# EAGLE design PT_2018_PB_4lyr_Rev1 (EAGLE 8.4.1)
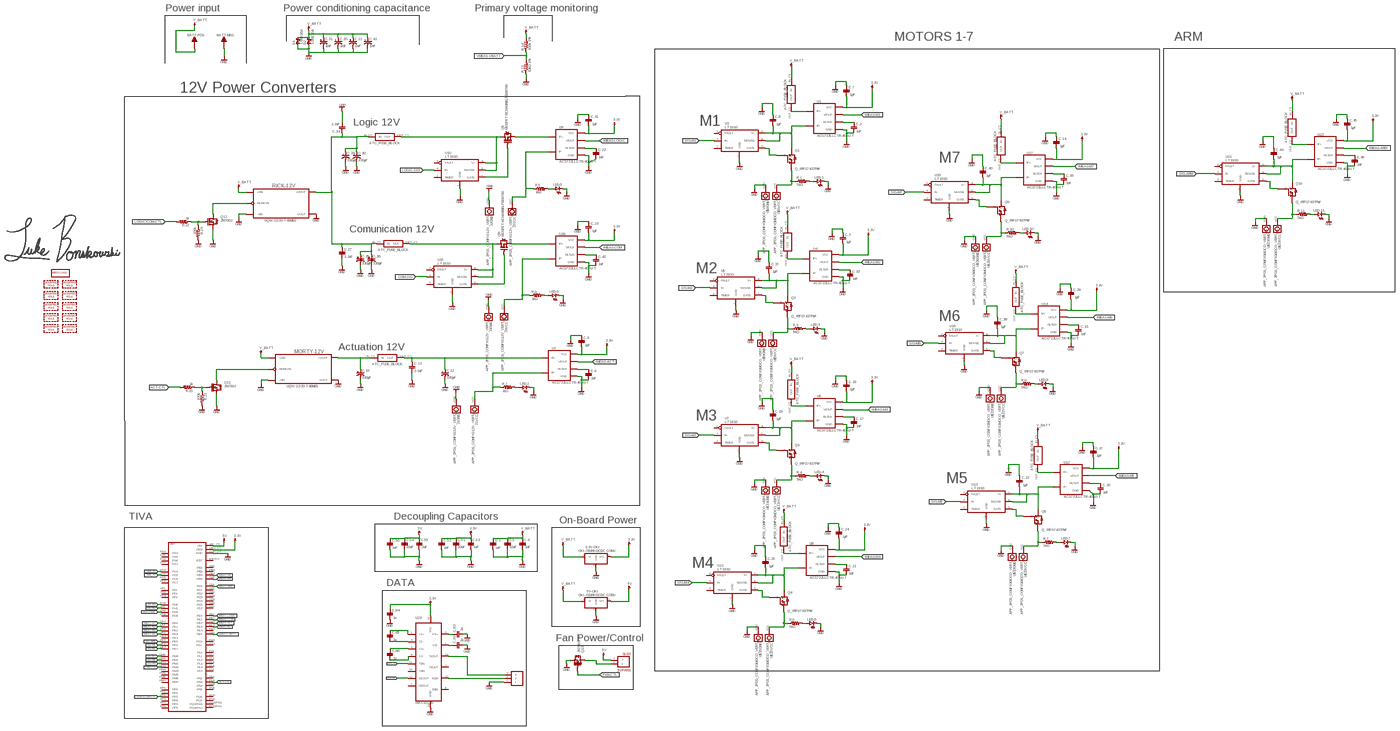
[diagram p0: schematic, sheet 1, overview]
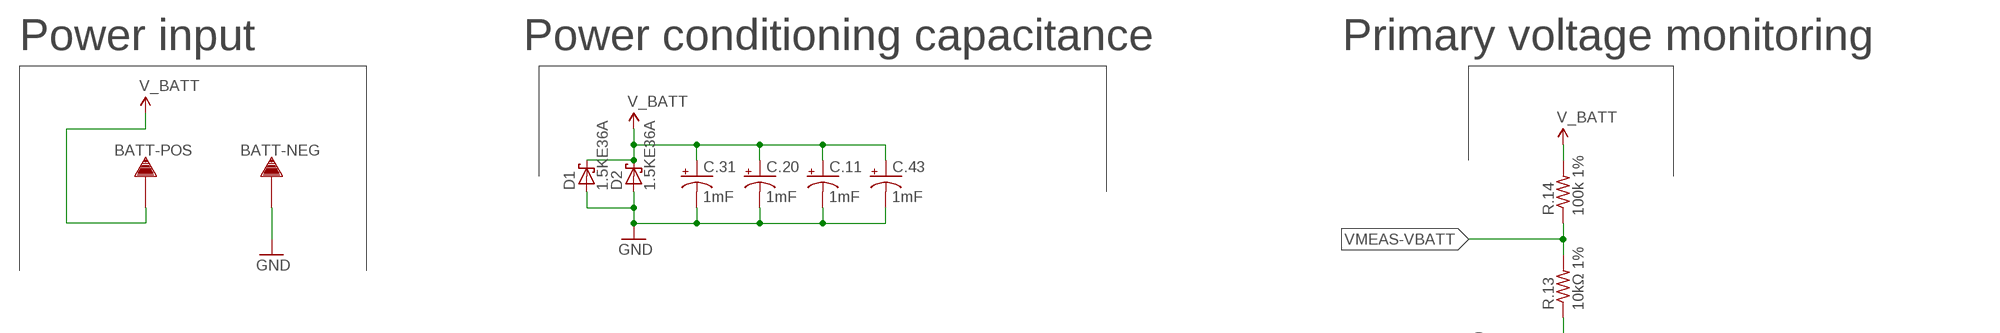
[diagram p1: schematic, sheet 1, part 1 of 4]
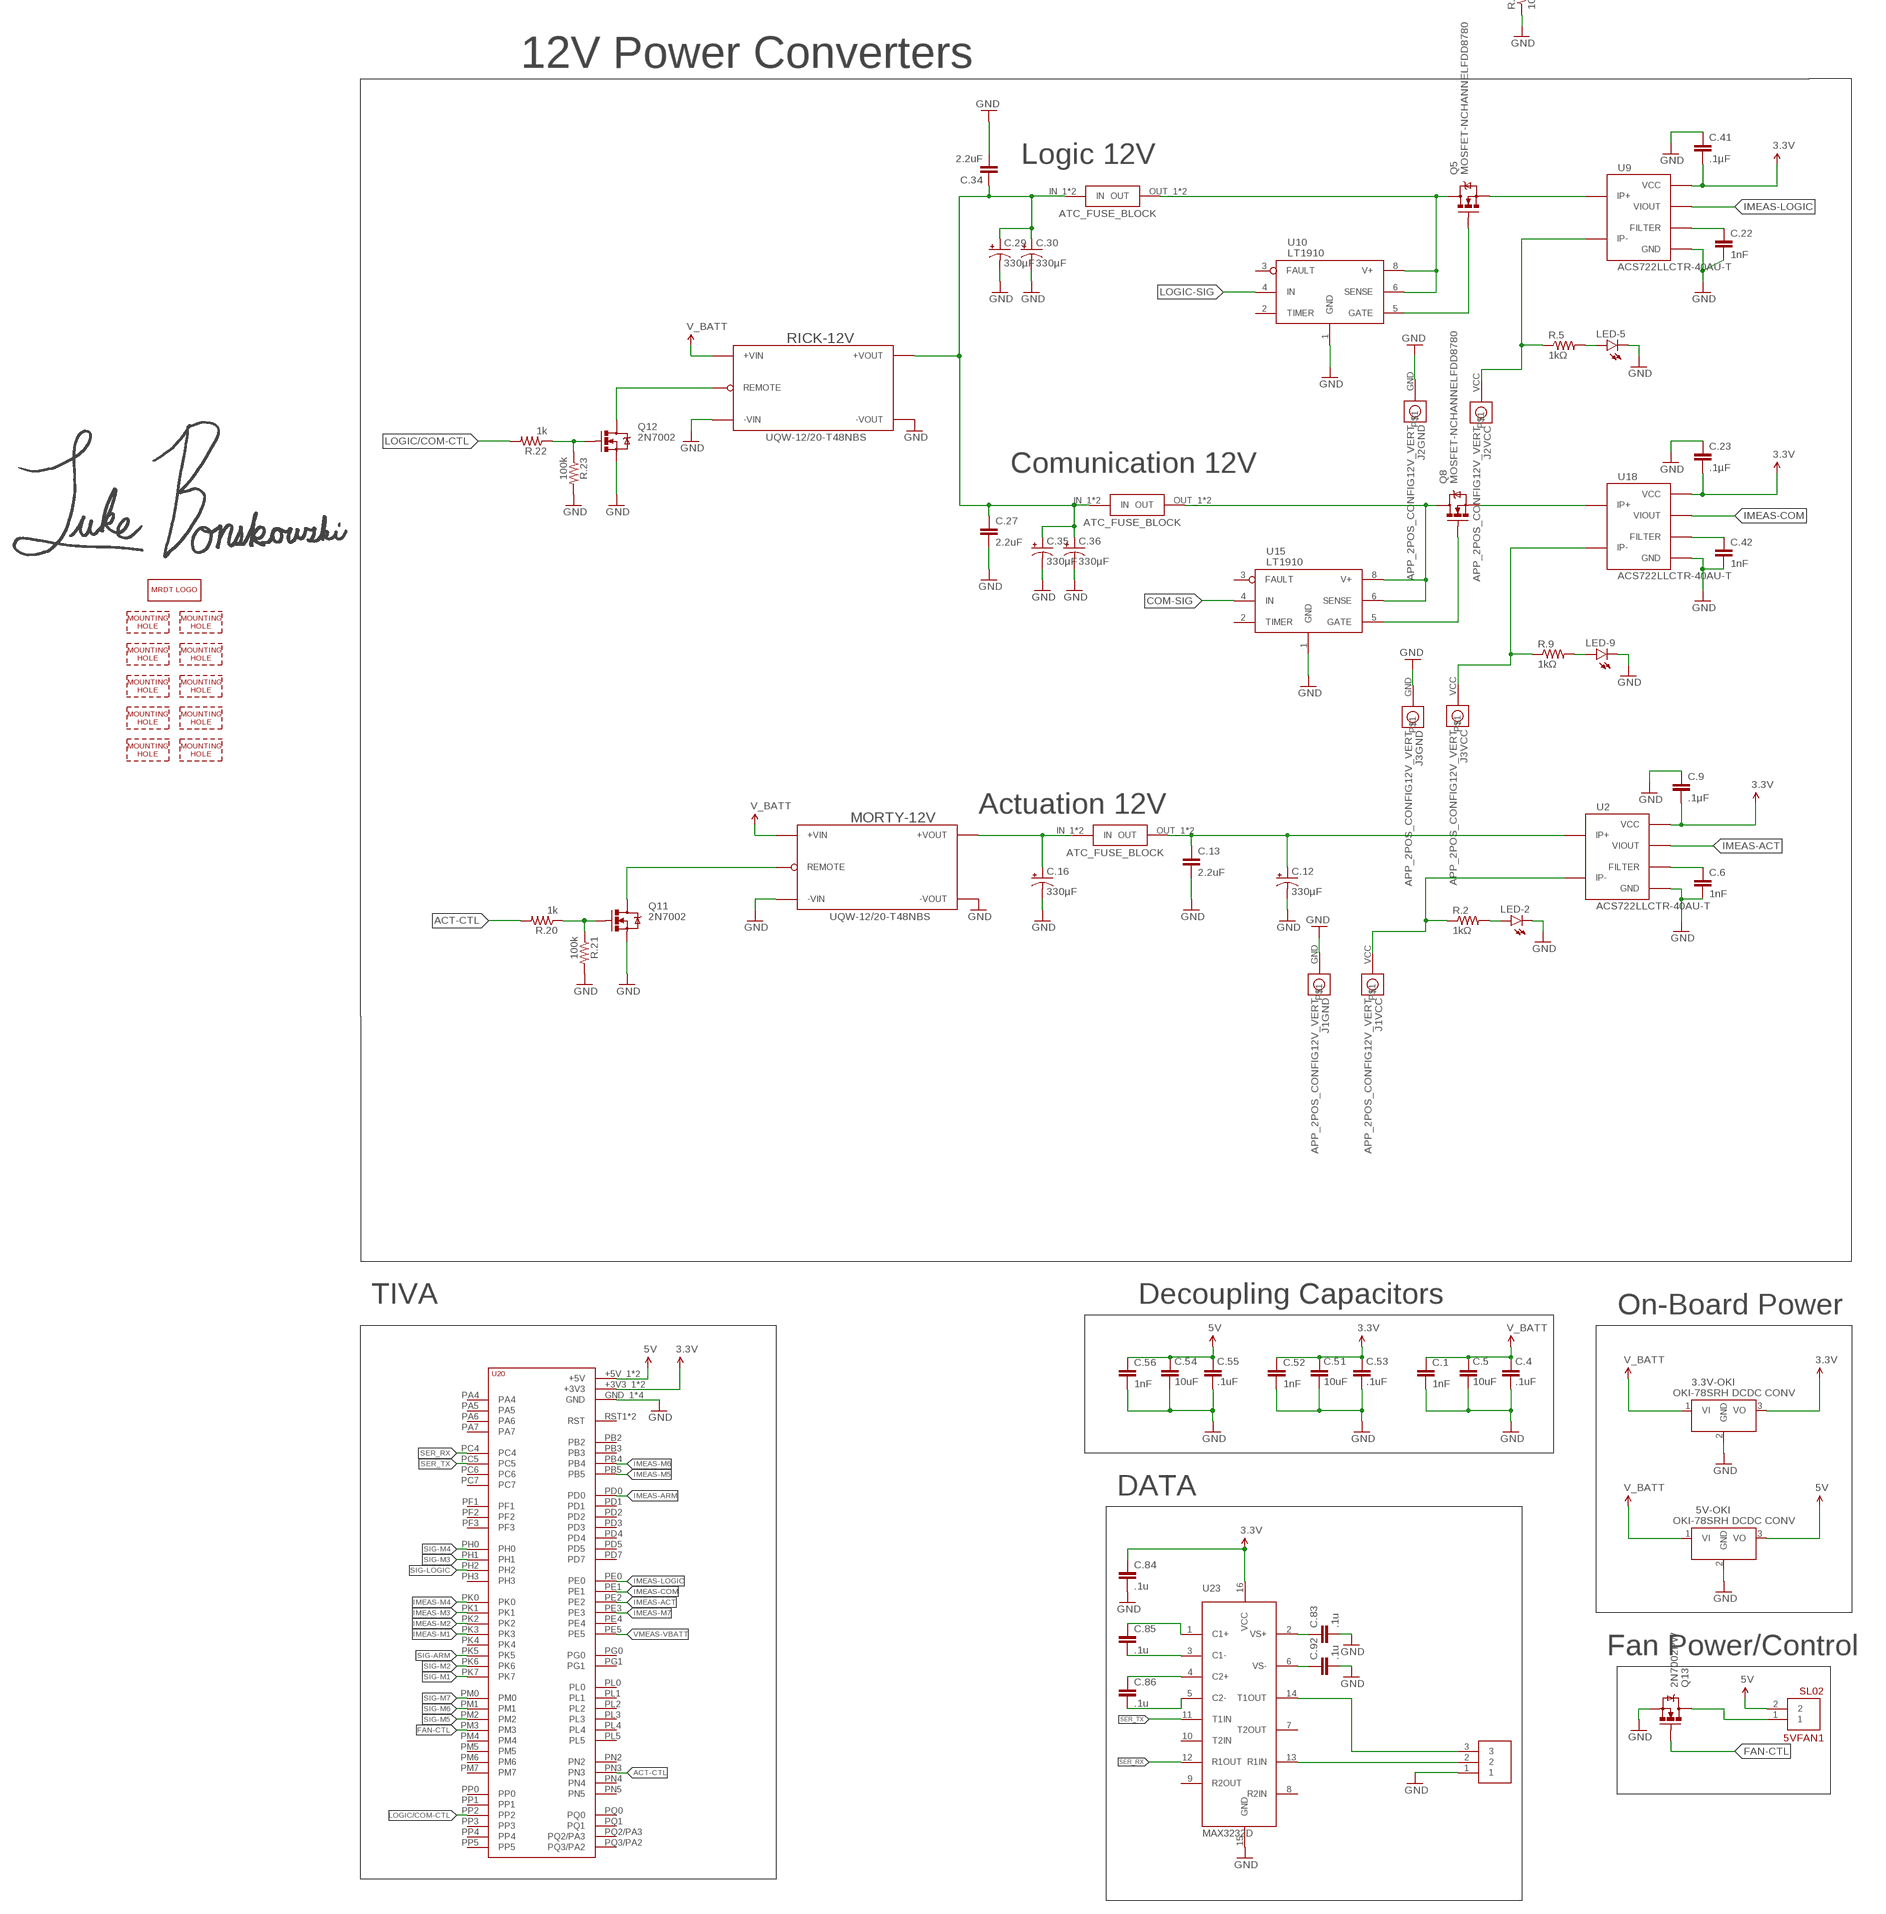
[diagram p2: schematic, sheet 1, part 2 of 4]
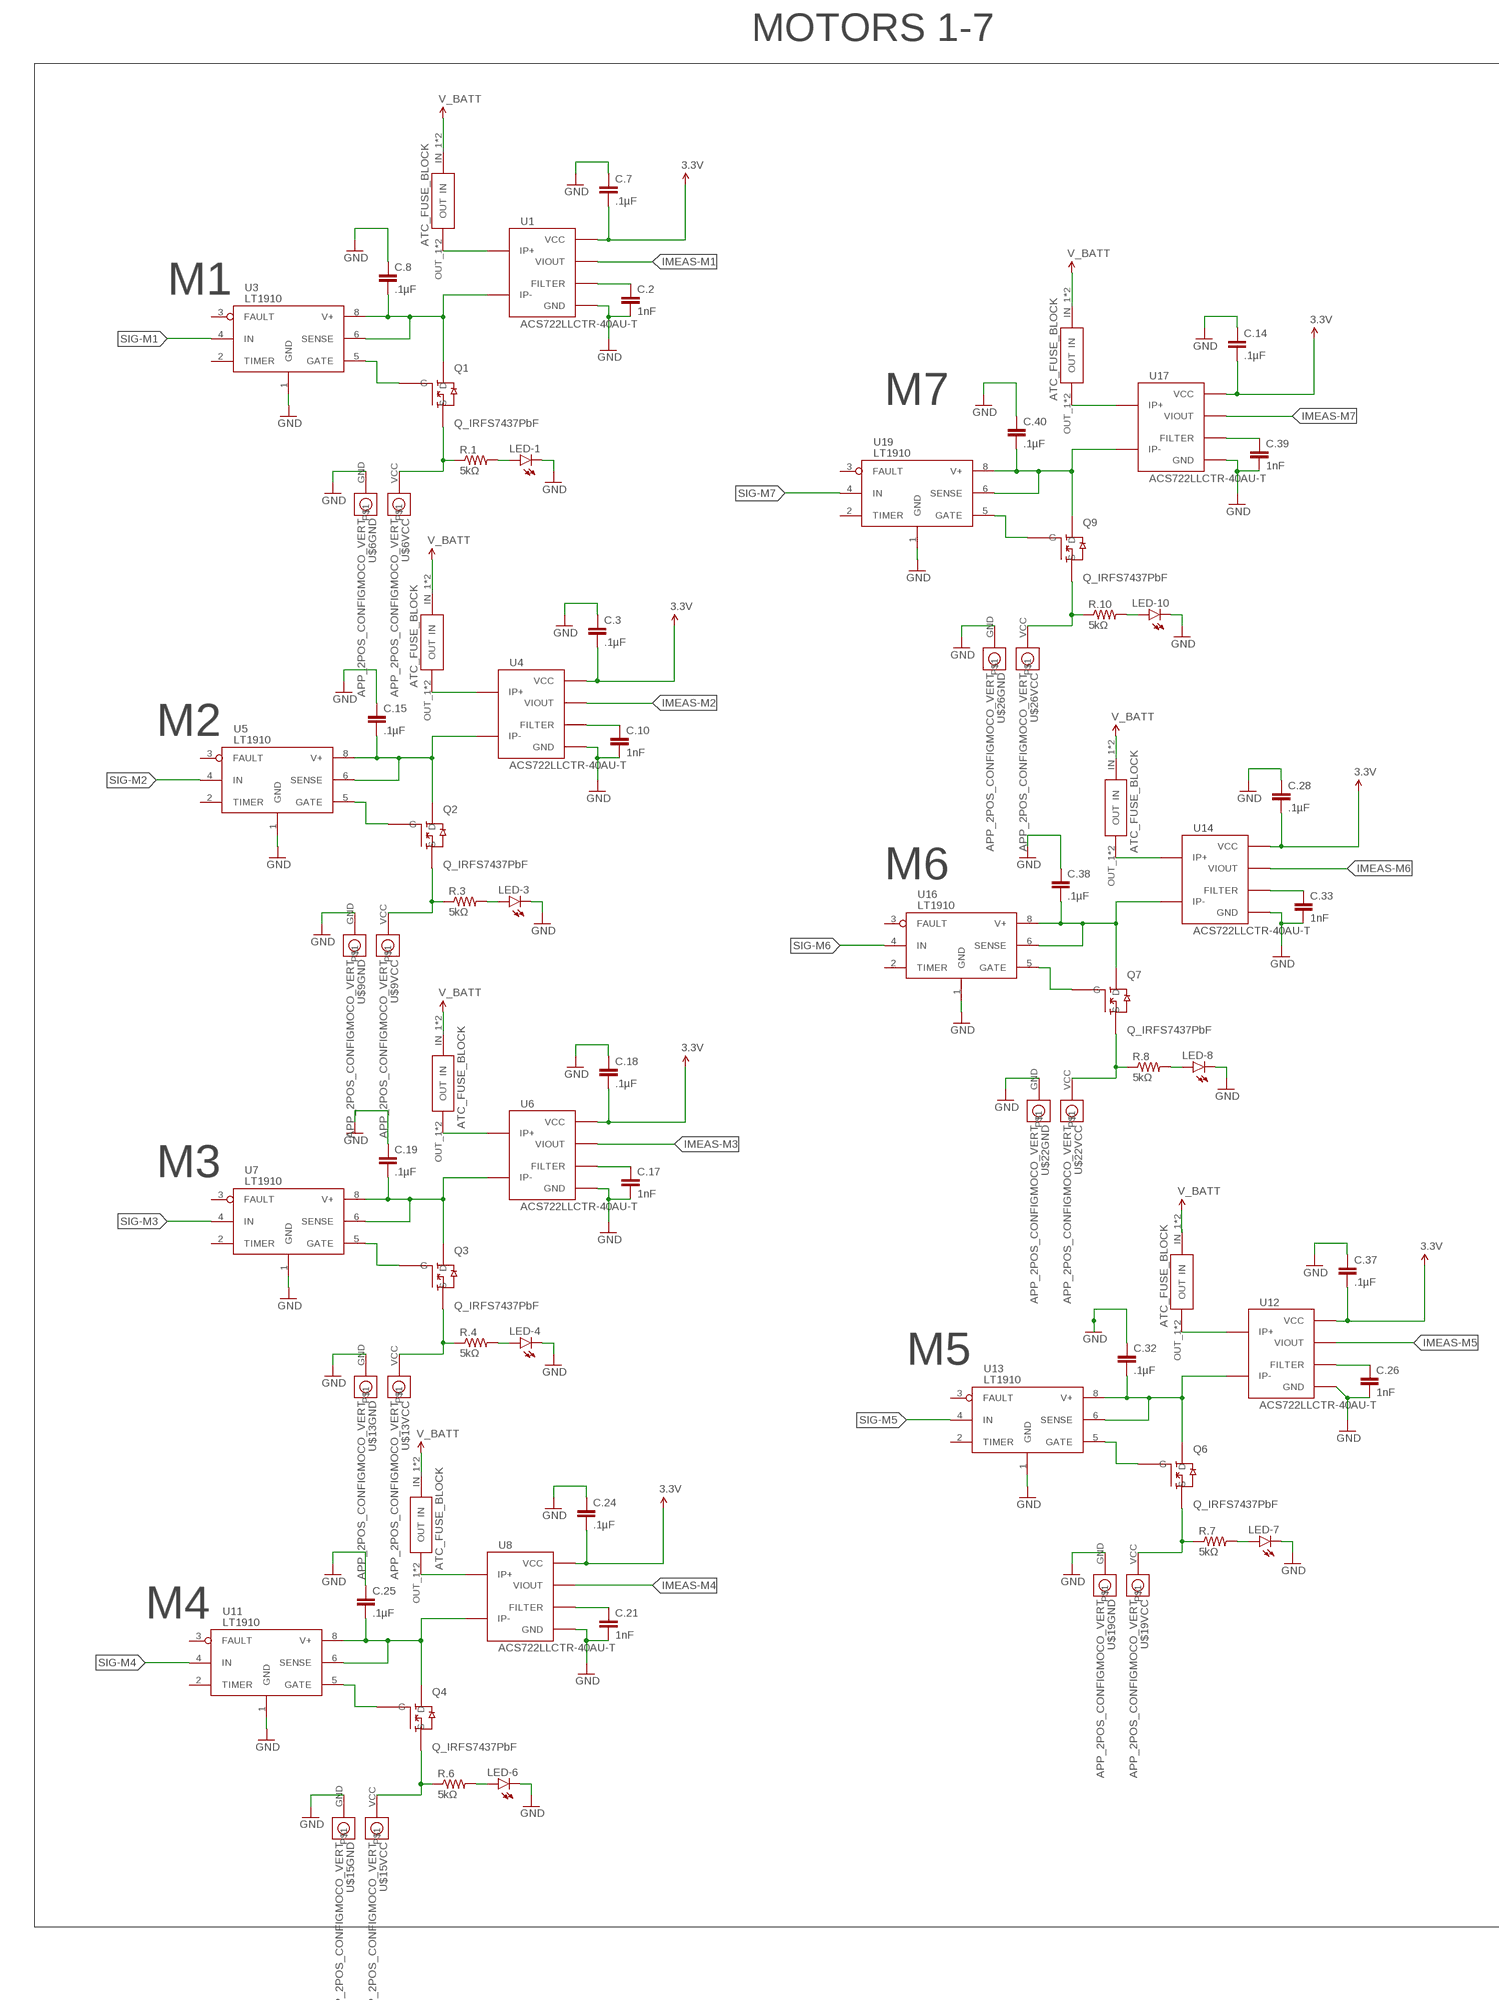
[diagram p3: schematic, sheet 1, part 3 of 4]
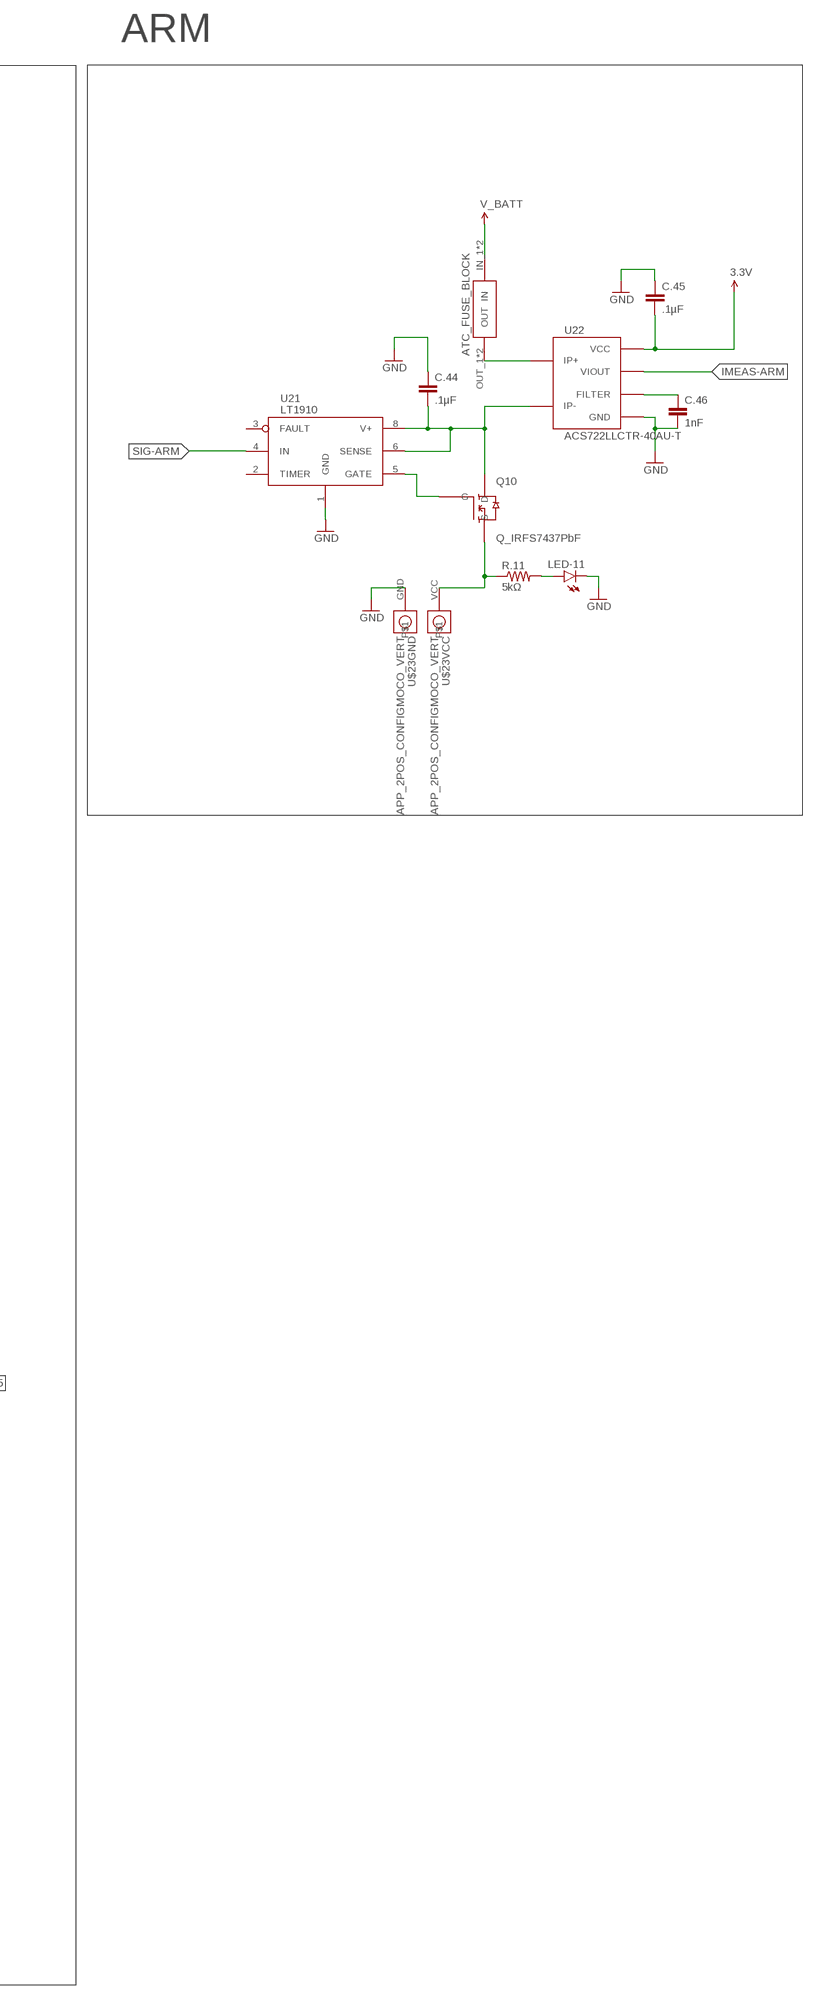
[diagram p4: schematic, sheet 1, part 4 of 4]

## Parts
3.3V-OKI  Q_OKI-78SR  [OKI-78SR_HORIZ]
5V-OKI  Q_OKI-78SR  [OKI-78SR_HORIZ]
5VFAN1  SL02  [MOLEX-70543-0001]
BATT-NEG  TERMINAL_HOLE  [LARGE_TERMINAL_HOLE]
BATT-POS  TERMINAL_HOLE  [LARGE_TERMINAL_HOLE]
BMS_SERIAL  SL03  [MOLEX-70543-0002]
C.1  1nF  CAP0805  [0805]
C.2  1nF  CAP0805  [0805]
C.3  .1µF  CAP0805  [0805]
C.4  .1uF  CAP0805  [0805]
C.5  10uF  CAP1206  [1206]
C.6  1nF  CAP0805  [0805]
C.7  .1µF  CAP0805  [0805]
C.8  .1µF  CAP0805  [0805]
C.9  .1µF  CAP0805  [0805]
C.10  1nF  CAP0805  [0805]
C.11  1mF  C_POL12.5MM_NORMAL  [C_12.5MM]
C.12  330µF  CPOL-USE5-8.5  [E5-8,5]
C.13  2.2uF  CAP1206  [1206]
C.14  .1µF  CAP0805  [0805]
C.15  .1µF  CAP0805  [0805]
C.16  330µF  CPOL-USE5-8.5  [E5-8,5]
C.17  1nF  CAP0805  [0805]
C.18  .1µF  CAP0805  [0805]
C.19  .1µF  CAP0805  [0805]
C.20  1mF  C_POL12.5MM_NORMAL  [C_12.5MM]
C.21  1nF  CAP0805  [0805]
C.22  1nF  CAP0805  [0805]
C.23  .1µF  CAP0805  [0805]
C.24  .1µF  CAP0805  [0805]
C.25  .1µF  CAP0805  [0805]
C.26  1nF  CAP0805  [0805]
C.27  2.2uF  CAP1206  [1206]
C.28  .1µF  CAP0805  [0805]
C.29  330µF  CPOL-USE5-8.5  [E5-8,5]
C.30  330µF  CPOL-USE5-8.5  [E5-8,5]
C.31  1mF  C_POL12.5MM_NORMAL  [C_12.5MM]
C.32  .1µF  CAP0805  [0805]
C.33  1nF  CAP0805  [0805]
C.34  2.2uF  CAP1206  [1206]
C.35  330µF  CPOL-USE5-8.5  [E5-8,5]
C.36  330µF  CPOL-USE5-8.5  [E5-8,5]
C.37  .1µF  CAP0805  [0805]
C.38  .1µF  CAP0805  [0805]
C.39  1nF  CAP0805  [0805]
C.40  .1µF  CAP0805  [0805]
C.41  .1µF  CAP0805  [0805]
C.42  1nF  CAP0805  [0805]
C.43  1mF  C_POL12.5MM_NORMAL  [C_12.5MM]
C.44  .1µF  CAP0805  [0805]
C.45  .1µF  CAP0805  [0805]
C.46  1nF  CAP0805  [0805]
C.51  10uF  CAP1206  [1206]
C.52  1nF  CAP0805  [0805]
C.53  .1uF  CAP0805  [0805]
C.54  10uF  CAP1206  [1206]
C.55  .1uF  CAP0805  [0805]
C.56  1nF  CAP0805  [0805]
C.83  .1u  CAP0805  [0805]
C.84  .1u  CAP0805  [0805]
C.85  .1u  CAP0805  [0805]
C.86  .1u  CAP0805  [0805]
C.92  .1u  CAP0805  [0805]
D1  1.5KE36A  15KEXX  [CB429-17]
D2  1.5KE36A  15KEXX  [CB429-17]
J1  APP_2POS_CONFIG12V_VERT  [APP45_12V_VERT_CONFIG]
J2  APP_2POS_CONFIG12V_VERT  [APP45_12V_VERT_CONFIG]
J3  APP_2POS_CONFIG12V_VERT  [APP45_12V_VERT_CONFIG]
LED-1  LED1206  [LED-1206]
LED-2  LED1206  [LED-1206]
LED-3  LED1206  [LED-1206]
LED-4  LED1206  [LED-1206]
LED-5  LED1206  [LED-1206]
LED-6  LED1206  [LED-1206]
LED-7  LED1206  [LED-1206]
LED-8  LED1206  [LED-1206]
LED-9  LED1206  [LED-1206]
LED-10  LED1206  [LED-1206]
LED-11  LED1206  [LED-1206]
MORTY-12V  UQW-12/20-T48NBS  [U-T48-QB-NO_TRIM]
Q1  Q_IRFS7437PbF  Q_IRF7437SMD  [D2PACK]
Q2  Q_IRFS7437PbF  Q_IRF7437SMD  [D2PACK]
Q3  Q_IRFS7437PbF  Q_IRF7437SMD  [D2PACK]
Q4  Q_IRFS7437PbF  Q_IRF7437SMD  [D2PACK]
Q5  MOSFET-NCHANNELFDD8780  [DPAK]
Q6  Q_IRFS7437PbF  Q_IRF7437SMD  [D2PACK]
Q7  Q_IRFS7437PbF  Q_IRF7437SMD  [D2PACK]
Q8  MOSFET-NCHANNELFDD8780  [DPAK]
Q9  Q_IRFS7437PbF  Q_IRF7437SMD  [D2PACK]
Q10  Q_IRFS7437PbF  Q_IRF7437SMD  [D2PACK]
Q11  2N7002  MOSFET-NCHANNEL2N7002PW  [SOT323]
Q12  2N7002  MOSFET-NCHANNEL2N7002PW  [SOT323]
Q13  2N7002PW  MOSFET-NCHANNEL2N7002PW  [SOT323]
R.1  5kΩ  RESISTOR1206  [1206]
R.2  1kΩ  RESISTOR1206  [1206]
R.3  5kΩ  RESISTOR1206  [1206]
R.4  5kΩ  RESISTOR1206  [1206]
R.5  1kΩ  RESISTOR1206  [1206]
R.6  5kΩ  RESISTOR1206  [1206]
R.7  5kΩ  RESISTOR1206  [1206]
R.8  5kΩ  RESISTOR1206  [1206]
R.9  1kΩ  RESISTOR1206  [1206]
R.10  5kΩ  RESISTOR1206  [1206]
R.11  5kΩ  RESISTOR1206  [1206]
R.13  10kΩ 1%  R-US_R1206  [R1206]
R.14  100k 1%  R-US_R1206  [R1206]
R.20  1k  R-US_R1206  [R1206]
R.21  100k  R-US_R1206  [R1206]
R.22  1k  R-US_R1206  [R1206]
R.23  100k  R-US_R1206  [R1206]
RICK-12V  UQW-12/20-T48NBS  [U-T48-QB-NO_TRIM]
U1  ACS722LLCTR-40AU-T  Q_ACS714  [SOIC8_ACS711]
U2  ACS722LLCTR-40AU-T  Q_ACS714  [SOIC8_ACS711]
U3  LT1910  [SO8]
U4  ACS722LLCTR-40AU-T  Q_ACS714  [SOIC8_ACS711]
U5  LT1910  [SO8]
U6  ACS722LLCTR-40AU-T  Q_ACS714  [SOIC8_ACS711]
U7  LT1910  [SO8]
U8  ACS722LLCTR-40AU-T  Q_ACS714  [SOIC8_ACS711]
U9  ACS722LLCTR-40AU-T  Q_ACS714  [SOIC8_ACS711]
U10  LT1910  [SO8]
U11  LT1910  [SO8]
U12  ACS722LLCTR-40AU-T  Q_ACS714  [SOIC8_ACS711]
U13  LT1910  [SO8]
U14  ACS722LLCTR-40AU-T  Q_ACS714  [SOIC8_ACS711]
U15  LT1910  [SO8]
U16  LT1910  [SO8]
U17  ACS722LLCTR-40AU-T  Q_ACS714  [SOIC8_ACS711]
U18  ACS722LLCTR-40AU-T  Q_ACS714  [SOIC8_ACS711]
U19  LT1910  [SO8]
U20  TIVA-1294  [TIVA-C-CONNECTED]
U21  LT1910  [SO8]
U22  ACS722LLCTR-40AU-T  Q_ACS714  [SOIC8_ACS711]
U23  MAX3232D  [SOIC16]
U$1  MOUNTING_HOLE#6  [#6_SCREW]
U$2  MOUNTING_HOLE#6  [#6_SCREW]
U$3  MOUNTING_HOLE#6  [#6_SCREW]
U$4  MOUNTING_HOLE#6  [#6_SCREW]
U$5  ATC_FUSE_BLOCK  [BLOCK_3557-2]
U$6  APP_2POS_CONFIGMOCO_VERT  [APP45_MOCO_VERT_CONFIG]
U$7  ATC_FUSE_BLOCK  [BLOCK_3557-2]
U$8  MRDT_LOGO  [MRDT_LOGO]
U$9  APP_2POS_CONFIGMOCO_VERT  [APP45_MOCO_VERT_CONFIG]
U$10  ATC_FUSE_BLOCK  [BLOCK_3557-2]
U$11  ATC_FUSE_BLOCK  [BLOCK_3557-2]
U$12  MOUNTING_HOLE#6  [#6_SCREW]
U$13  APP_2POS_CONFIGMOCO_VERT  [APP45_MOCO_VERT_CONFIG]
U$14  ATC_FUSE_BLOCK  [BLOCK_3557-2]
U$15  APP_2POS_CONFIGMOCO_VERT  [APP45_MOCO_VERT_CONFIG]
U$16  ATC_FUSE_BLOCK  [BLOCK_3557-2]
U$17  ATC_FUSE_BLOCK  [BLOCK_3557-2]
U$18  MOUNTING_HOLE#6  [#6_SCREW]
U$19  APP_2POS_CONFIGMOCO_VERT  [APP45_MOCO_VERT_CONFIG]
U$20  ATC_FUSE_BLOCK  [BLOCK_3557-2]
U$21  ATC_FUSE_BLOCK  [BLOCK_3557-2]
U$22  APP_2POS_CONFIGMOCO_VERT  [APP45_MOCO_VERT_CONFIG]
U$23  APP_2POS_CONFIGMOCO_VERT  [APP45_MOCO_VERT_CONFIG]
U$24  MOUNTING_HOLE#6  [#6_SCREW]
U$25  ATC_FUSE_BLOCK  [BLOCK_3557-2]
U$26  APP_2POS_CONFIGMOCO_VERT  [APP45_MOCO_VERT_CONFIG]
U$27  LUCAS_BONSKOWSKI_SIGNATURE  [LUCAS_BONSKOWSKI_SIGNATURE]
U$28  MOUNTING_HOLE#6  [#6_SCREW]
U$29  ATC_FUSE_BLOCK  [BLOCK_3557-2]
U$30  MOUNTING_HOLE#6  [#6_SCREW]
U$31  MOUNTING_HOLE#6  [#6_SCREW]

## Nets
3.3V: 3.3V-OKI.3(VO) C.3.2 C.7.2 C.9.2 C.14.2 C.18.2 C.23.2 C.24.2 C.28.2 C.37.2 C.41.2 C.45.2 C.51.1 C.52.1 C.53.1 C.84.1 U1.8(VCC) U2.8(VCC) U4.8(VCC) U6.8(VCC) U8.8(VCC) U9.8(VCC) U12.8(VCC) U14.8(VCC) U17.8(VCC) U18.8(VCC) U20.+3V3_1(+3V3) U20.+3V3_2(+3V3) U22.8(VCC) U23.16(VCC)
5V: 5V-OKI.3(VO) 5VFAN1.2 C.54.1 C.55.1 C.56.1 U20.+5V_1(+5V) U20.+5V_2(+5V)
12V-AUX-ACT: J1.VCC R.2.1 U2.4(IP-)
12V-AUX-COM: J3.VCC R.9.1 U18.4(IP-)
12V-AUX-LOGIC: J2.VCC R.5.1 U9.4(IP-)
232_RX: BMS_SERIAL.2 U23.13(R1IN)
232_TX: BMS_SERIAL.3 U23.14(T1OUT)
ACT-CTL: R.20.2 U20.PN3
COM-SIG: U15.4(IN)
DRAIN-ARM: C.44.2 Q10.TAB(D) U21.6(SENSE) U21.8(V+) U22.4(IP-)
DRAIN-M1: C.8.2 Q1.TAB(D) U1.4(IP-) U3.6(SENSE) U3.8(V+)
DRAIN-M2: C.15.2 Q2.TAB(D) U4.4(IP-) U5.6(SENSE) U5.8(V+)
DRAIN-M3: C.19.2 Q3.TAB(D) U6.4(IP-) U7.6(SENSE) U7.8(V+)
DRAIN-M4: C.25.2 Q4.TAB(D) U8.4(IP-) U11.6(SENSE) U11.8(V+)
DRAIN-M5: C.32.2 Q6.TAB(D) U12.4(IP-) U13.6(SENSE) U13.8(V+)
DRAIN-M6: C.38.2 Q7.TAB(D) U14.4(IP-) U16.6(SENSE) U16.8(V+)
DRAIN-M7: C.40.2 Q9.TAB(D) U17.4(IP-) U19.6(SENSE) U19.8(V+)
FAN-CTL: Q13.1(G) U20.PM3
FILTER-ARM: C.46.1 U22.6(FILTER)
FILTER-M1: C.2.1 U1.6(FILTER)
FILTER-M2: C.10.1 U4.6(FILTER)
FILTER-M3: C.17.1 U6.6(FILTER)
FILTER-M4: C.21.1 U8.6(FILTER)
FILTER-M5: C.26.1 U12.6(FILTER)
FILTER-M6: C.33.1 U14.6(FILTER)
FILTER-M7: C.39.1 U17.6(FILTER)
GATE-ARM: Q10.1(G) U21.5(GATE)
GATE-M1: Q1.1(G) U3.5(GATE)
GATE-M2: Q2.1(G) U5.5(GATE)
GATE-M3: Q3.1(G) U7.5(GATE)
GATE-M4: Q4.1(G) U11.5(GATE)
GATE-M5: Q6.1(G) U13.5(GATE)
GATE-M6: Q7.1(G) U16.5(GATE)
GATE-M7: Q9.1(G) U19.5(GATE)
GND: 3.3V-OKI.2(GND) 5V-OKI.2(GND) BATT-NEG.P$1 BMS_SERIAL.1 C.1.2 C.2.2 C.3.1 C.4.2 C.5.2 C.6.2 C.7.1 C.8.1 C.9.1 C.10.2 C.11.- C.12.- C.13.2 C.14.1 C.15.1 C.16.- C.17.2 C.18.1 C.19.1 C.20.- C.21.2 C.22.2 C.23.1 C.24.1 C.25.1 C.26.2 C.27.2 C.28.1 C.29.- C.30.- C.31.- C.32.1 C.33.2 C.34.2 C.35.- C.36.- C.37.1 C.38.1 C.39.2 C.40.1 C.41.1 C.42.2 C.43.- C.44.1 C.45.1 C.46.2 C.51.2 C.52.2 C.53.2 C.54.2 C.55.2 C.56.2 C.83.2 C.84.2 C.92.2 D1.A D2.A J1.GND J2.GND J3.GND LED-1.C LED-2.C LED-3.C LED-4.C LED-5.C LED-6.C LED-7.C LED-8.C LED-9.C LED-10.C LED-11.C MORTY-12V.3(-VIN) MORTY-12V.4(-VOUT) Q11.2(S) Q12.2(S) Q13.2(S) R.13.1 R.21.2 R.23.2 RICK-12V.3(-VIN) RICK-12V.4(-VOUT) U1.5(GND) U2.5(GND) U3.1(GND) U4.5(GND) U5.1(GND) U6.5(GND) U7.1(GND) U8.5(GND) U9.5(GND) U10.1(GND) U11.1(GND) U12.5(GND) U13.1(GND) U14.5(GND) U15.1(GND) U16.1(GND) U17.5(GND) U18.5(GND) U19.1(GND) U20.GND_1(GND) U20.GND_2(GND) U20.GND_3(GND) U20.GND_4(GND) U21.1(GND) U22.5(GND) U23.15(GND) U$6.GND U$9.GND U$13.GND U$15.GND U$19.GND U$22.GND U$23.GND U$26.GND
IMEAS-ACT: U2.7(VIOUT) U20.PE2
IMEAS-ARM: U20.PD0 U22.7(VIOUT)
IMEAS-COM: U18.7(VIOUT) U20.PE1
IMEAS-LOGIC: U9.7(VIOUT) U20.PE0
IMEAS-M1: U1.7(VIOUT) U20.PK3
IMEAS-M2: U4.7(VIOUT) U20.PK2
IMEAS-M3: U6.7(VIOUT) U20.PK1
IMEAS-M4: U8.7(VIOUT) U20.PK0
IMEAS-M5: U12.7(VIOUT) U20.PB5
IMEAS-M6: U14.7(VIOUT) U20.PB4
IMEAS-M7: U17.7(VIOUT) U20.PE3
LEDLINE-ARM: LED-11.A R.11.2
LEDLINE-M1: LED-1.A R.1.2
LEDLINE-M2: LED-3.A R.3.2
LEDLINE-M3: LED-4.A R.4.2
LEDLINE-M4: LED-6.A R.6.2
LEDLINE-M5: LED-7.A R.7.2
LEDLINE-M6: LED-8.A R.8.2
LEDLINE-M7: LED-10.A R.10.2
LOGIC-SIG: U10.4(IN)
LOGIC/COM-CTL: R.22.2 U20.PP2
N$1: C.16.+ MORTY-12V.8(+VOUT) U$7.IN_1(IN) U$7.IN_2(IN)
N$3: Q12.3(D) RICK-12V.2(REMOTE)
N$4: C.22.1 U9.6(FILTER)
N$5: 5VFAN1.1 Q13.3(D)
N$6: LED-2.A R.2.2
N$7: LED-9.A R.9.2
N$8: MORTY-12V.2(REMOTE) Q11.3(D)
N$9: C.27.1 C.29.+ C.30.+ C.34.1 C.35.+ C.36.+ RICK-12V.8(+VOUT) U$16.IN_1(IN) U$16.IN_2(IN) U$20.IN_1(IN) U$20.IN_2(IN)
N$11: C.83.1 U23.2(VS+)
N$12: C.6.1 U2.6(FILTER)
N$15: C.42.1 U18.6(FILTER)
N$16: LED-5.A R.5.2
N$17: Q8.1(G) U15.5(GATE)
N$18: C.12.+ C.13.1 U2.1(IP+) U$7.OUT_1(OUT) U$7.OUT_2(OUT)
N$19: Q8.3(S) U18.1(IP+)
N$20: Q8.4(D) U15.6(SENSE) U15.8(V+) U$20.OUT_1(OUT) U$20.OUT_2(OUT)
N$21: Q5.4(D) U10.6(SENSE) U10.8(V+) U$16.OUT_1(OUT) U$16.OUT_2(OUT)
N$22: Q5.3(S) U9.1(IP+)
N$25: Q11.1(G) R.20.1 R.21.1
N$28: Q5.1(G) U10.5(GATE)
N$40: C.85.1 U23.1(C1+)
N$42: C.85.2 U23.3(C1-)
N$43: C.86.1 U23.4(C2+)
N$44: C.86.2 U23.5(C2-)
N$45: C.92.1 U23.6(VS-)
N$114: Q12.1(G) R.22.1 R.23.1
SER_RX: U20.PC4 U23.12(R1OUT)
SER_TX: U20.PC5 U23.11(T1IN)
SIG-ARM: U20.PK5 U21.4(IN)
SIG-LOGIC: U20.PH2
SIG-M1: U3.4(IN) U20.PK7
SIG-M2: U5.4(IN) U20.PK6
SIG-M3: U7.4(IN) U20.PH1
SIG-M4: U11.4(IN) U20.PH0
SIG-M5: U13.4(IN) U20.PM2
SIG-M6: U16.4(IN) U20.PM1
SIG-M7: U19.4(IN) U20.PM0
SOURCE-ARM: Q10.2(S) R.11.1 U$23.VCC
SOURCE-M1: Q1.2(S) R.1.1 U$6.VCC
SOURCE-M2: Q2.2(S) R.3.1 U$9.VCC
SOURCE-M3: Q3.2(S) R.4.1 U$13.VCC
SOURCE-M4: Q4.2(S) R.6.1 U$15.VCC
SOURCE-M5: Q6.2(S) R.7.1 U$19.VCC
SOURCE-M6: Q7.2(S) R.8.1 U$22.VCC
SOURCE-M7: Q9.2(S) R.10.1 U$26.VCC
V_BATT: 3.3V-OKI.1(VI) 5V-OKI.1(VI) BATT-POS.P$1 C.1.1 C.4.1 C.5.1 C.11.+ C.20.+ C.31.+ C.43.+ D1.C D2.C MORTY-12V.1(+VIN) R.14.2 RICK-12V.1(+VIN) U$5.IN_1(IN) U$5.IN_2(IN) U$10.IN_1(IN) U$10.IN_2(IN) U$11.IN_1(IN) U$11.IN_2(IN) U$14.IN_1(IN) U$14.IN_2(IN) U$17.IN_1(IN) U$17.IN_2(IN) U$21.IN_1(IN) U$21.IN_2(IN) U$25.IN_1(IN) U$25.IN_2(IN) U$29.IN_1(IN) U$29.IN_2(IN)
V_BATT_ARM: U22.1(IP+) U$29.OUT_1(OUT) U$29.OUT_2(OUT)
V_BATT_M1: U1.1(IP+) U$5.OUT_1(OUT) U$5.OUT_2(OUT)
V_BATT_M2: U4.1(IP+) U$10.OUT_1(OUT) U$10.OUT_2(OUT)
V_BATT_M3: U6.1(IP+) U$11.OUT_1(OUT) U$11.OUT_2(OUT)
V_BATT_M4: U8.1(IP+) U$14.OUT_1(OUT) U$14.OUT_2(OUT)
V_BATT_M5: U12.1(IP+) U$17.OUT_1(OUT) U$17.OUT_2(OUT)
V_BATT_M6: U14.1(IP+) U$21.OUT_1(OUT) U$21.OUT_2(OUT)
V_BATT_M7: U17.1(IP+) U$25.OUT_1(OUT) U$25.OUT_2(OUT)
VMEAS-VBATT: R.13.2 R.14.1 U20.PE5
Unconnected: U3.2(TIMER) U3.3(FAULT) U5.2(TIMER) U5.3(FAULT) U7.2(TIMER) U7.3(FAULT) U10.2(TIMER) U10.3(FAULT) U11.2(TIMER) U11.3(FAULT) U13.2(TIMER) U13.3(FAULT) U15.2(TIMER) U15.3(FAULT) U16.2(TIMER) U16.3(FAULT) U19.2(TIMER) U19.3(FAULT) U20.PA4 U20.PA5 U20.PA6 U20.PA7 U20.PB2 U20.PB3 U20.PC6 U20.PC7 U20.PD1 U20.PD2 U20.PD3 U20.PD4 U20.PD5 U20.PD7 U20.PE4 U20.PF1 U20.PF2 U20.PF3 U20.PG0 U20.PG1 U20.PH3 U20.PK4 U20.PL0 U20.PL1 U20.PL2 U20.PL3 U20.PL4 U20.PL5 U20.PM4 U20.PM5 U20.PM6 U20.PM7 U20.PN2 U20.PN4 U20.PN5 U20.PP0 U20.PP1 U20.PP3 U20.PP4 U20.PP5 U20.PQ0 U20.PQ1 U20.PQ2/PA3 U20.PQ3/PA2 U20.RST1(RST) U20.RST_2(RST) U21.2(TIMER) U21.3(FAULT) U23.7(T2OUT) U23.8(R2IN) U23.9(R2OUT) U23.10(T2IN)

## Notes on the sheet
- Power input | Power conditioning capacitance | Primary voltage monitoring
- MOTORS 1-7 | ARM
- 12V Power Converters
- Logic 12V | M1
- M7
- Comunication 12V
- M2
- M6
- Actuation 12V
- M3
- M5
- TIVA | Decoupling Capacitors
- On-Board Power
- M4
- DATA
- Fan Power/Control

## Library data of the parts
3.3V-OKI 5V-OKI = MRDT-2015-PowerBoard:Q_OKI-78SR: 4.95W DC/DC Converter Manufacturer: Murata Part Number: OKI-78SR-5/1.5-W36H-C OKI-78SR-3.3/1.5-W36H-C
5VFAN1 = MRDT-Connectors:SL02
BATT-NEG BATT-POS = MRDT-2015-PowerBoard:TERMINAL_HOLE
BMS_SERIAL = MRDT-Connectors:SL03: Molex 3-pin SL connector Locking 3 pin connector with standard header spacing. Backward compatible with standard RC servo connectors.
C.1-C.10 C.13-C.15 C.17-C.19 C.21-C.28 C.32-C.34 C.37-C.42 C.44-C.46 C.51-C.56 = SparkFun-Capacitors:CAP: Capacitor Standard 0603 ceramic capacitor, and 0.1" leaded capacitor.
C.11 C.20 C.31 C.43 = MRDT-2014-All:C_POL: Alum Elect. Cap with 10mm diameter, 5mm lead spacing and 0.7mm lead diameter
C.12 C.16 C.29 C.30 C.35 C.36 = resistor:CPOL-US: POLARIZED CAPACITOR, American symbol
C.83-C.86 C.92 = SparkFun-Passives:CAP: Capacitor Standard 0603 ceramic capacitor, and 0.1" leaded capacitor.
D1 D2 = diode:15KEXX: DIODE
J1-J3 = MRDT-Connectors:APP_2POS_CONFIG; COLOR1: YELLOW; COLOR2: BLACK
LED-1-LED-11 = SparkFun-LED:LED: LEDs Standard schematic elements and footprints for 5mm, 3mm, 1206, and 0603 sized LEDs. 5mm - Spark Fun Electronics SKU : COM-00529 (and others)
MORTY-12V RICK-12V = MRDT-2015-PowerBoard:UQW-12/20-T48NBS
Q1-Q4 Q6 Q7 Q9 Q10 = MRDT-2015-PowerBoard:Q_IRF*7437: 40V 195A N-CH MOSFET switch with heatsink
Q5 Q8 = SparkFun-DiscreteSemi:MOSFET-NCHANNEL: Common NMOSFET Parts MFG P/N Store ID Prod ID FDD8780 TRANS-09984 SI7820DN TRANS-11055 FDS6630A IC-08089 2N7002PW TRANS-11151 FQP30N06L COM-10213 TRANS-10060 BSS123LT1G TRANS-08345 BSS138 TRANS-00830 BS170 2N7000; PROD_ID: TRANS-09984
Q11-Q13 = SparkFun-DiscreteSemi:MOSFET-NCHANNEL: Common NMOSFET Parts MFG P/N Store ID Prod ID FDD8780 TRANS-09984 SI7820DN TRANS-11055 FDS6630A IC-08089 2N7002PW TRANS-11151 FQP30N06L COM-10213 TRANS-10060 BSS123LT1G TRANS-08345 BSS138 TRANS-00830 BS170 2N7000; PROD_ID: TRANS-11151
R.1-R.11 = SparkFun-Passives:RESISTOR: Resistor Basic schematic elements and footprints for 0603, 1206, and PTH resistors.
R.13 R.14 R.20-R.23 = resistor:R-US_: RESISTOR, American symbol
U1 U2 U4 U6 U8 U9 U12 U14 U17 U18 U22 = MRDT-2015-PowerBoard:Q_ACS714: Sketch variant has increased clearance for traces.
U3 U5 U7 U10 U11 U13 U15 U16 U19 U21 = Jake:LT1910
U20 = MRDT-Microcontrollers:TIVA-1294: TIVA C CONNECTED LAUNCHPAD
U23 = MRDT-ICs:MAX*232; OPERATING_VOLTAGE: 3V3
U$1-U$4 U$12 U$18 U$24 U$28 U$30 U$31 = MRDT-Hardware:MOUNTING_HOLE: Mounting hole for M6 bolt. Standard use mounting hole for: Tiva C Connected - M6 Anderson Powerpole Mounting Wing - M8 Most frame-mounted PCB's - M8
U$5 U$7 U$10 U$11 U$14 U$16 U$17 U$20 U$21 U$25 U$29 = MRDT-Hardware:ATC_FUSE_BLOCK: FUSE BLOCK BLADE 500V 30A PCB - Part#36-3557-2-ND on Digikey
U$6 U$9 U$13 U$15 U$19 U$22 U$23 U$26 = MRDT-Connectors:APP_2POS_CONFIG; COLOR2: BLACK
U$8 = MRDT-2015-General:MRDT_LOGO
U$27 = MRDT-Signatures:LUCAS_BONSKOWSKI_SIGNATURE

## Net classes
2 fet_drive: width 0.508 mm, clearance 0.076 mm
3 Ethernet: width 0.22 mm, clearance 0.152 mm

## Board
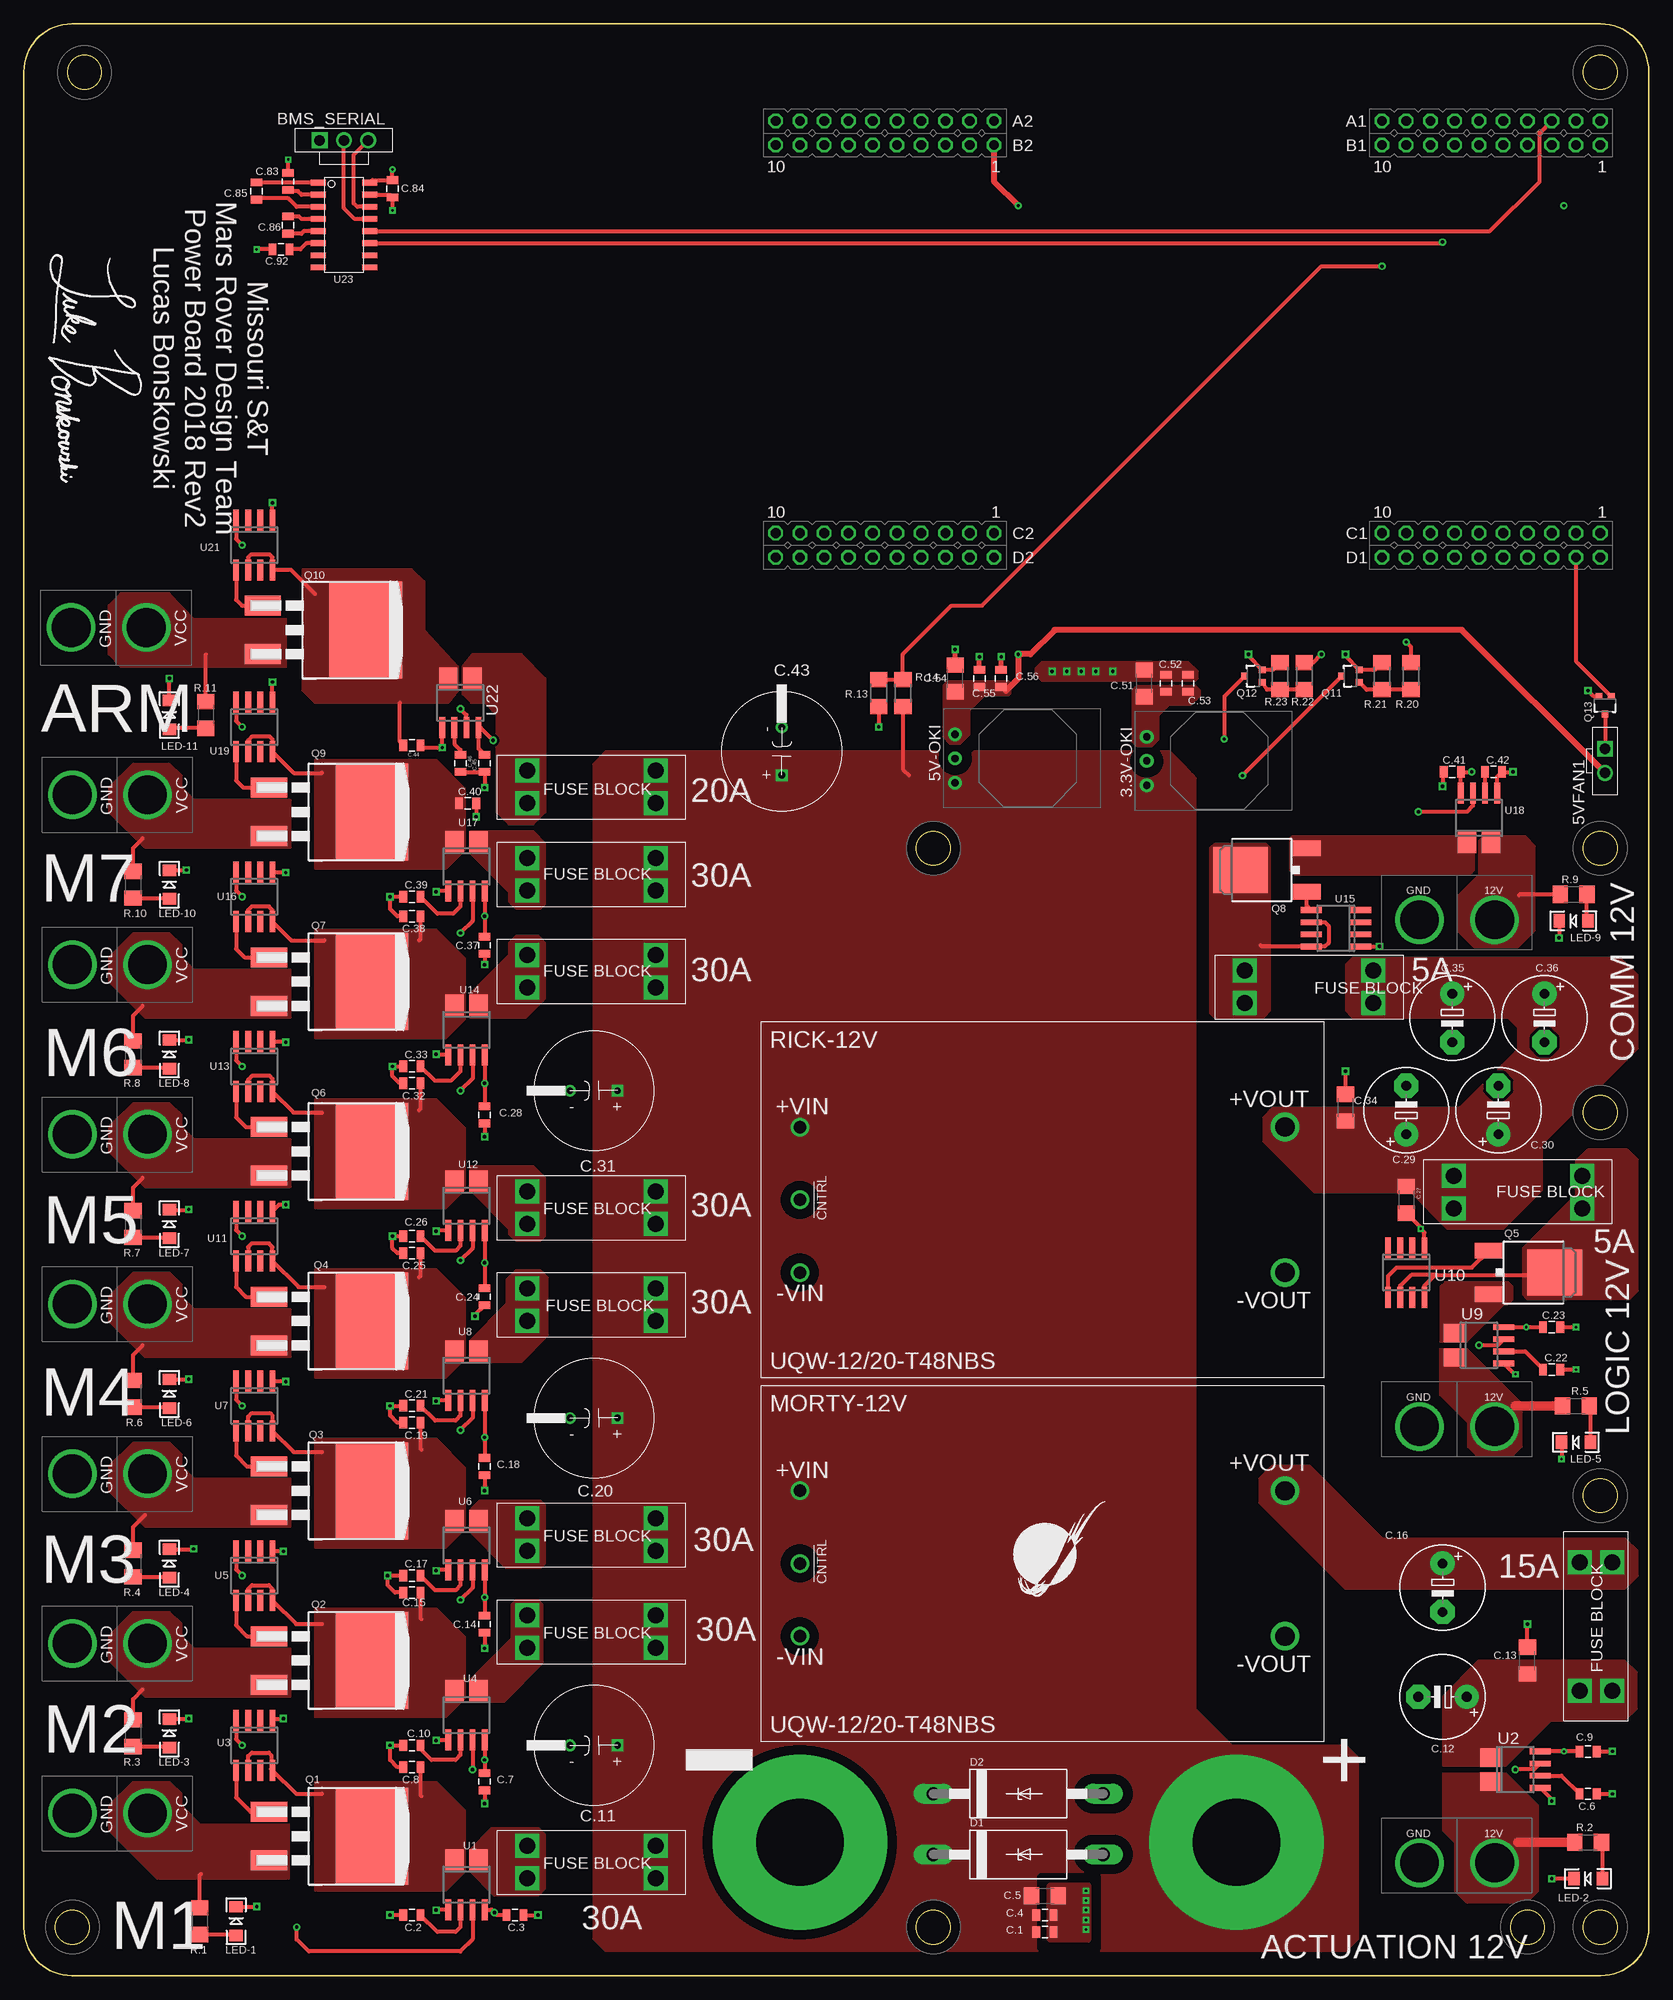
[diagram p5: board, top side]
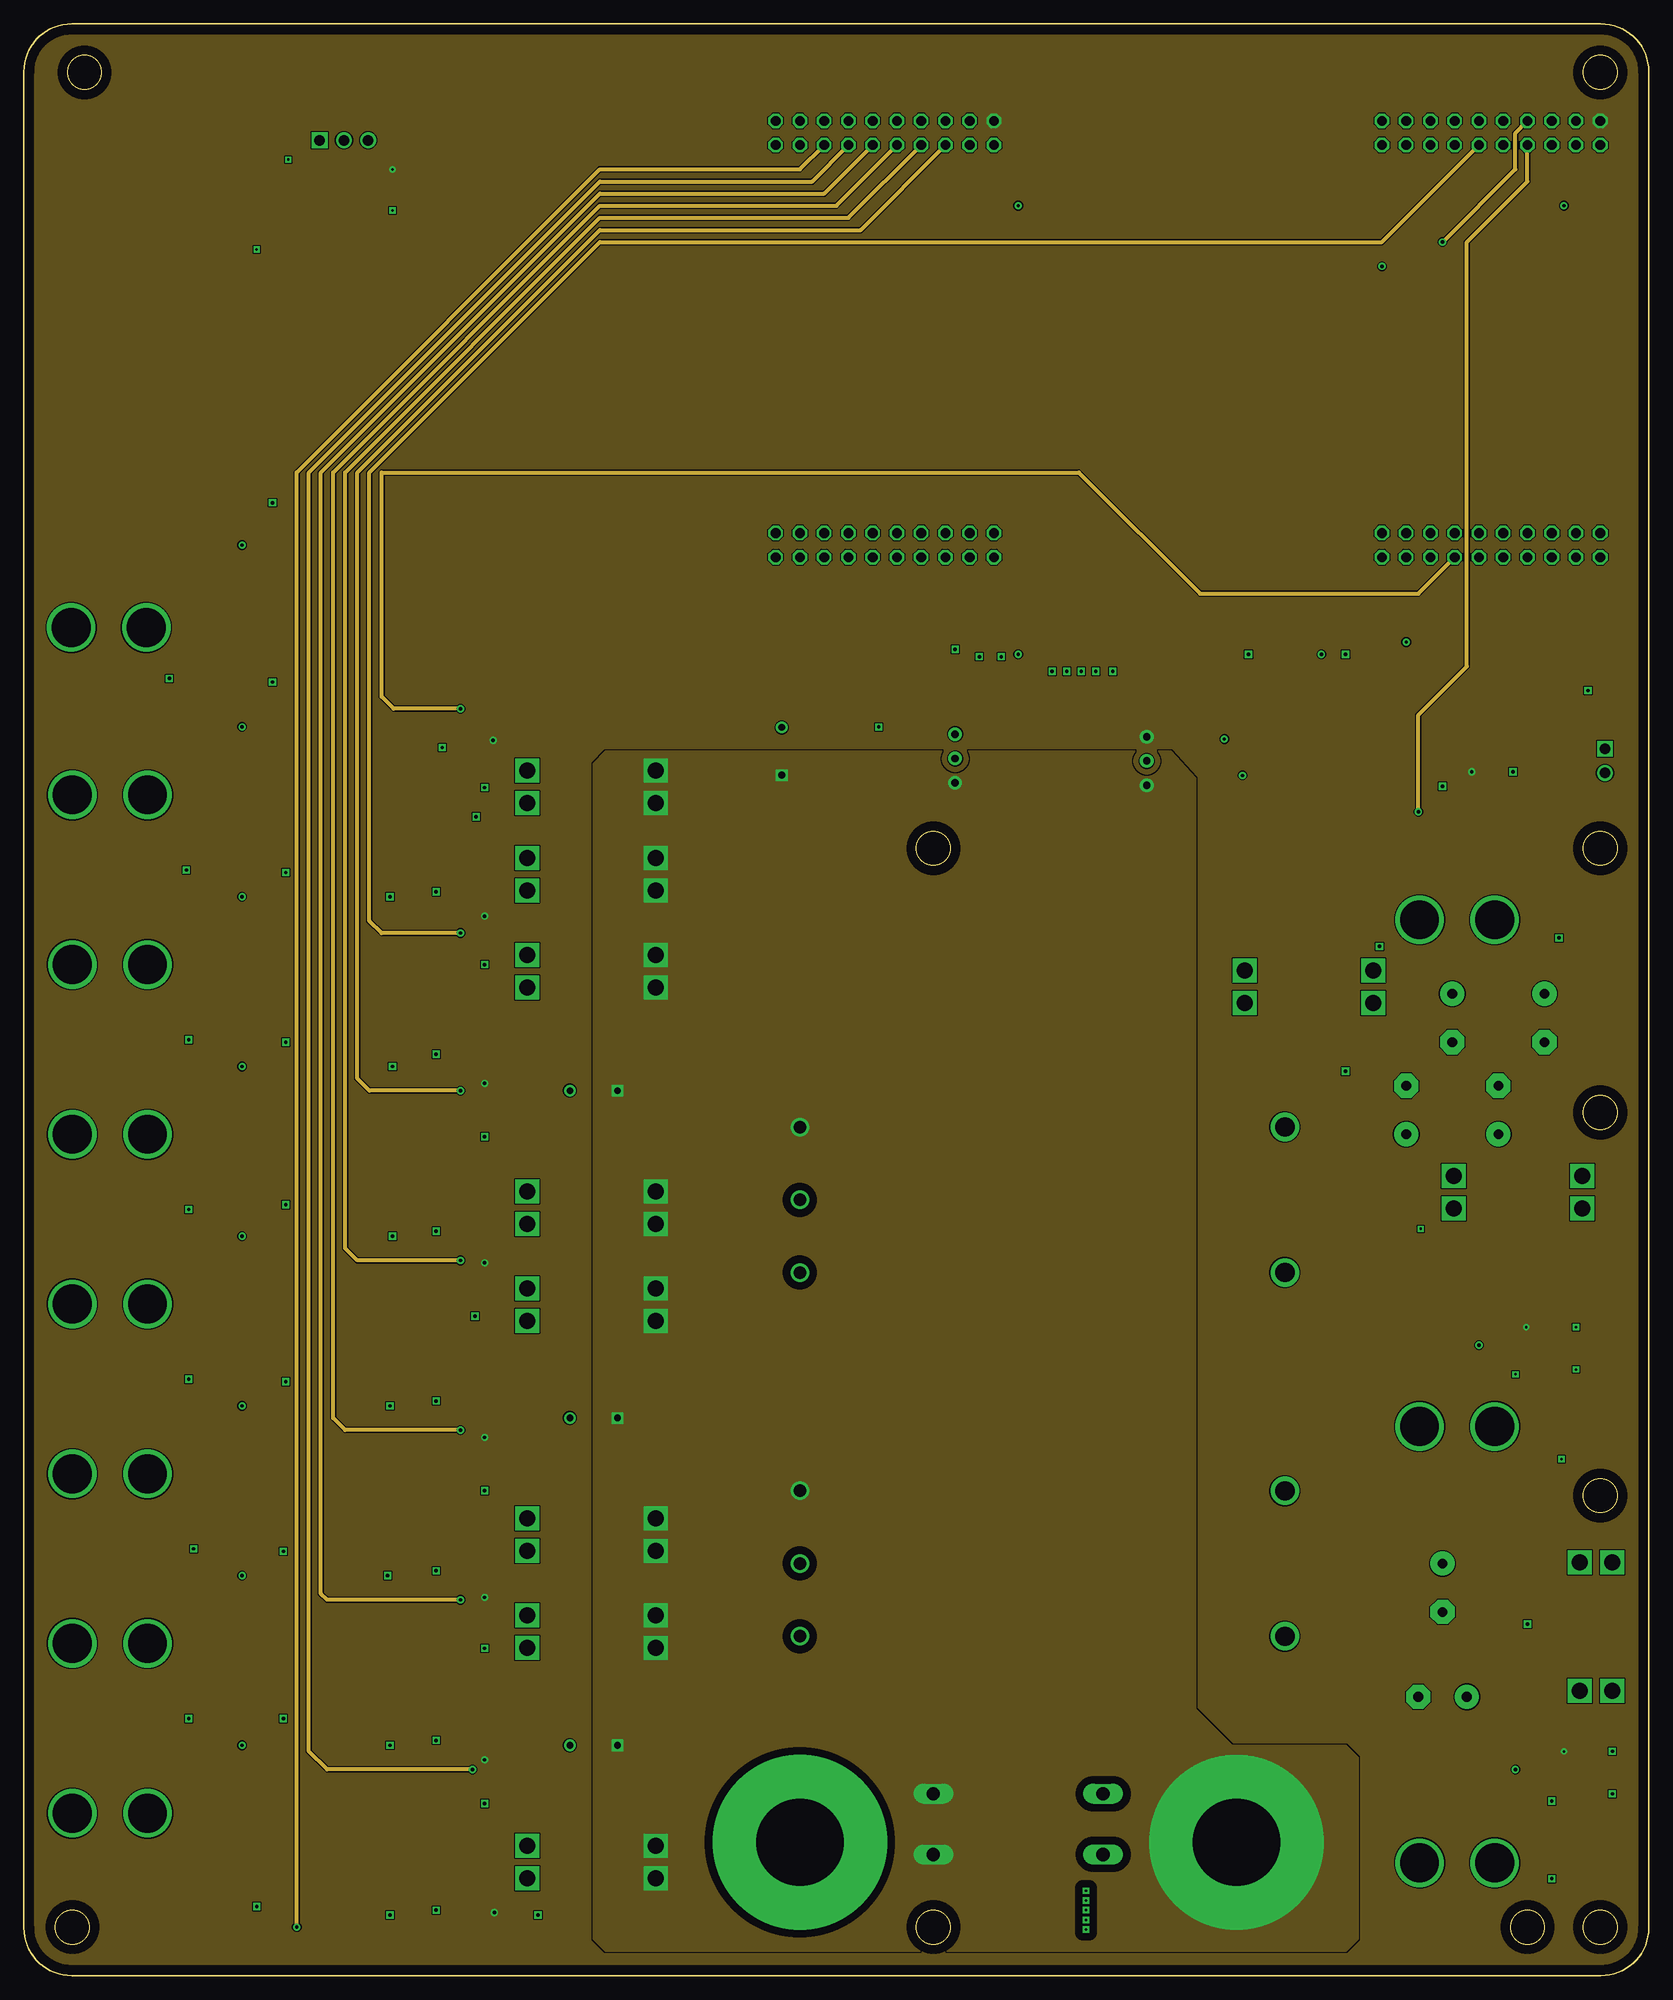
[diagram p6: board, inner layer Top-Mid(3v3)]
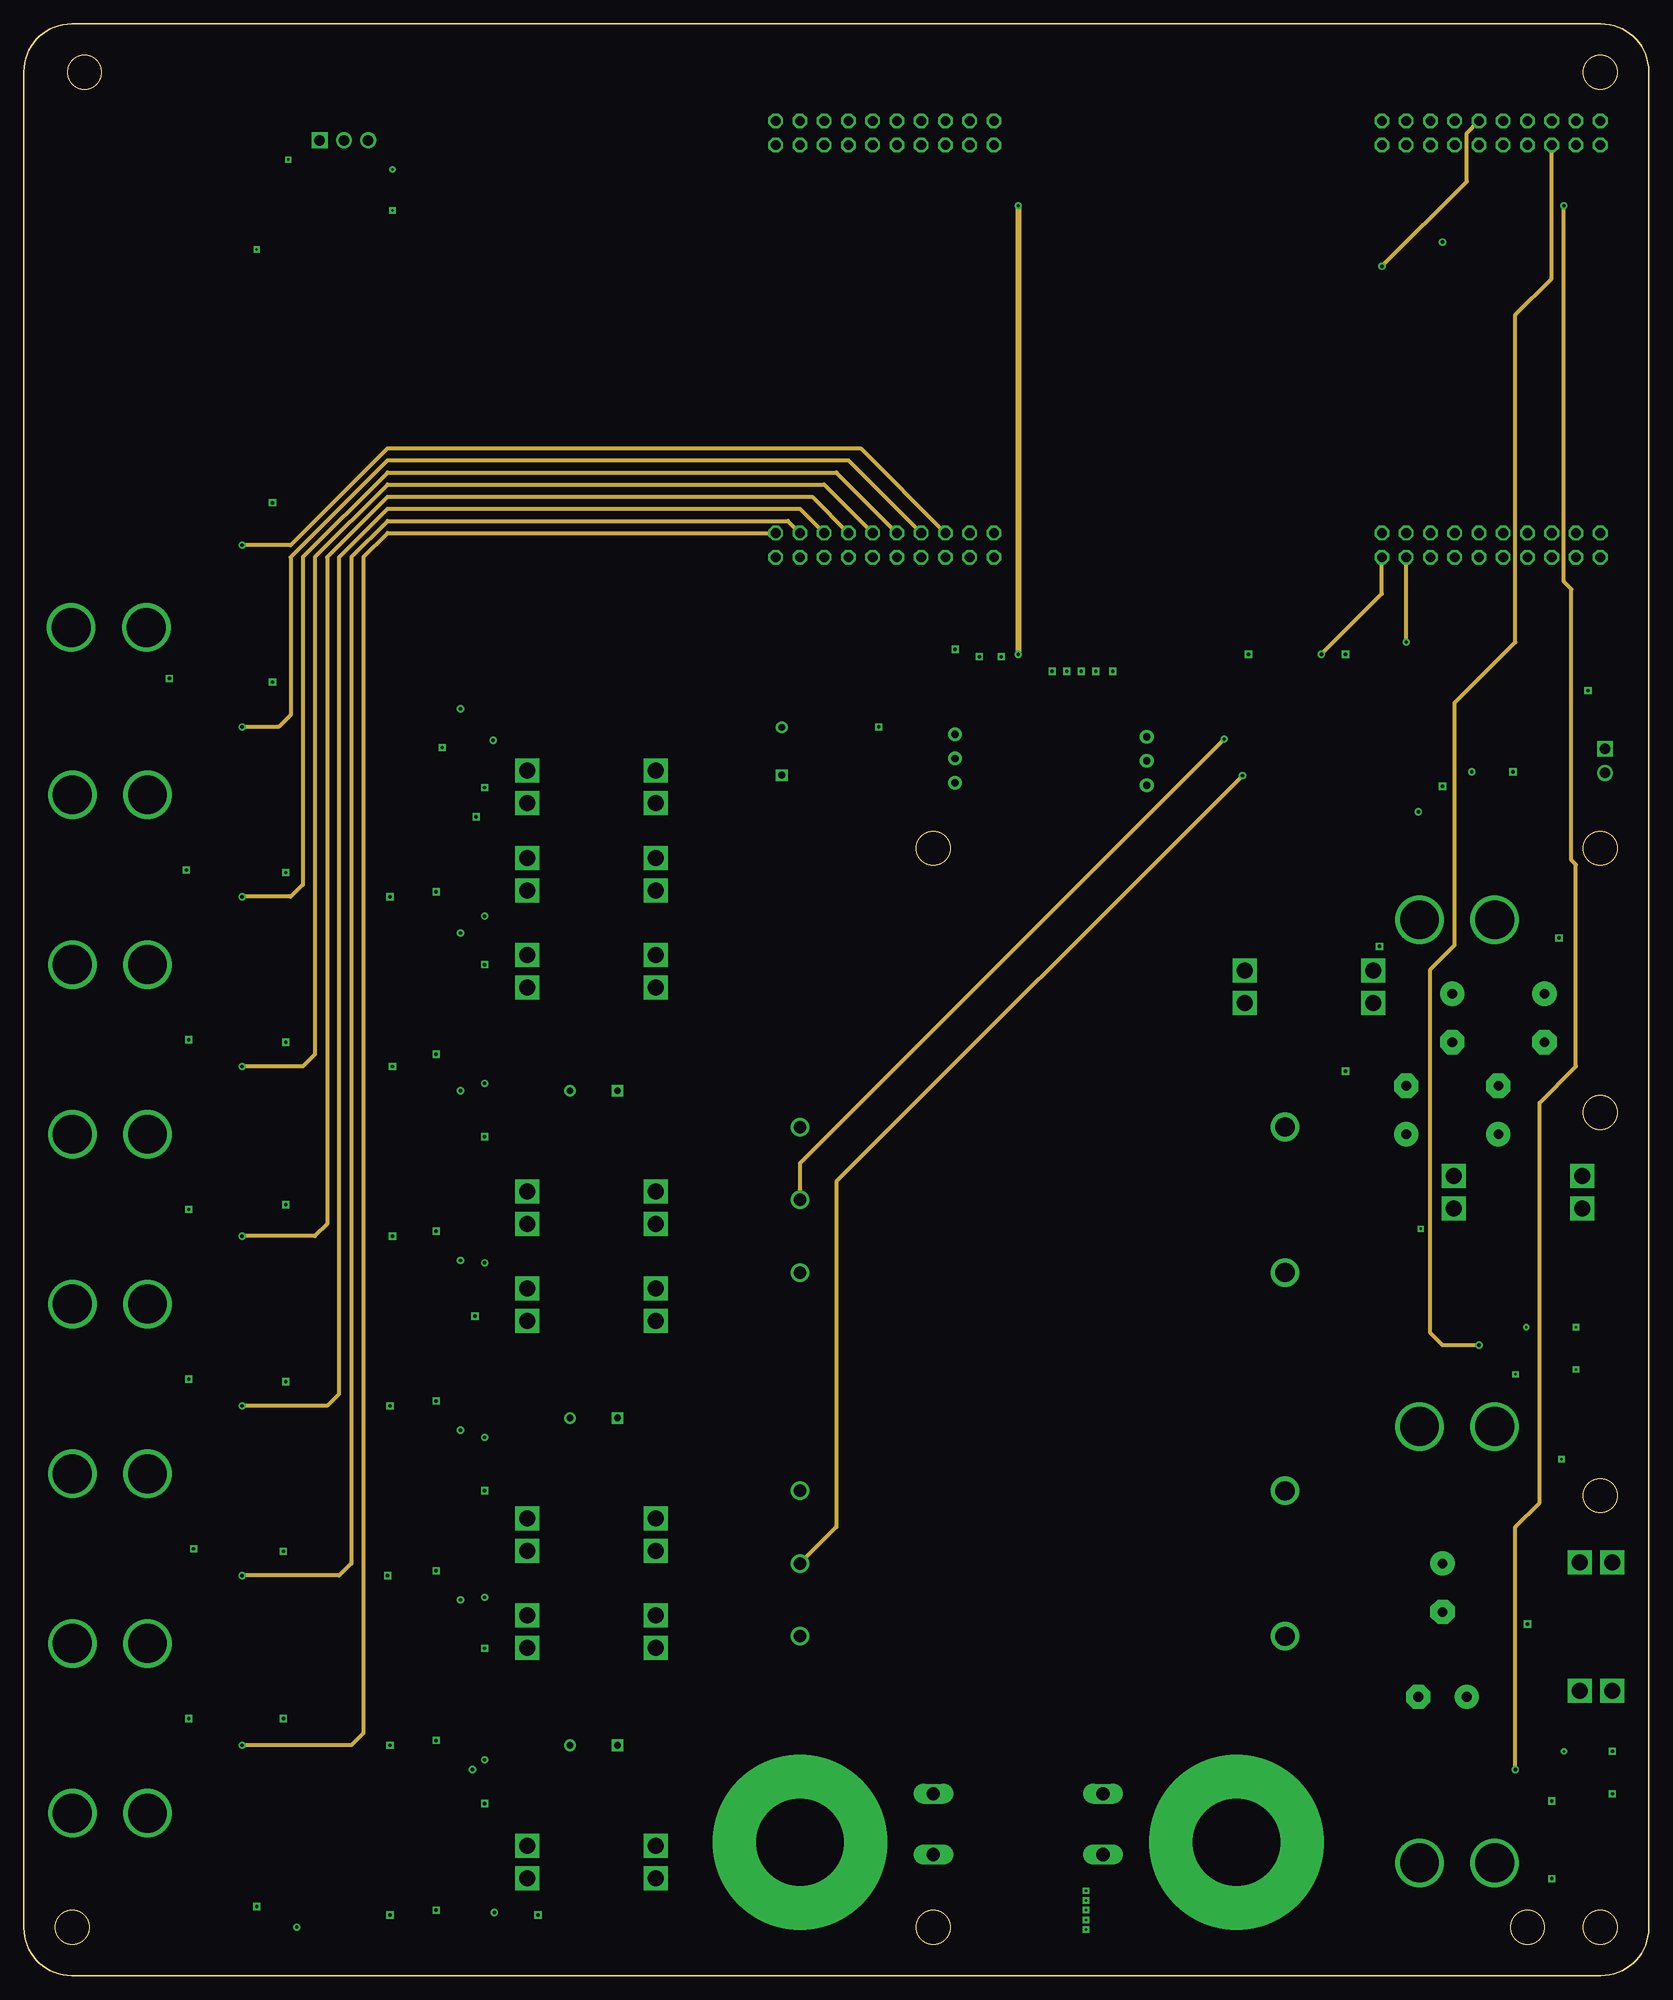
[diagram p7: board, inner layer Bot-Mid(signal)]
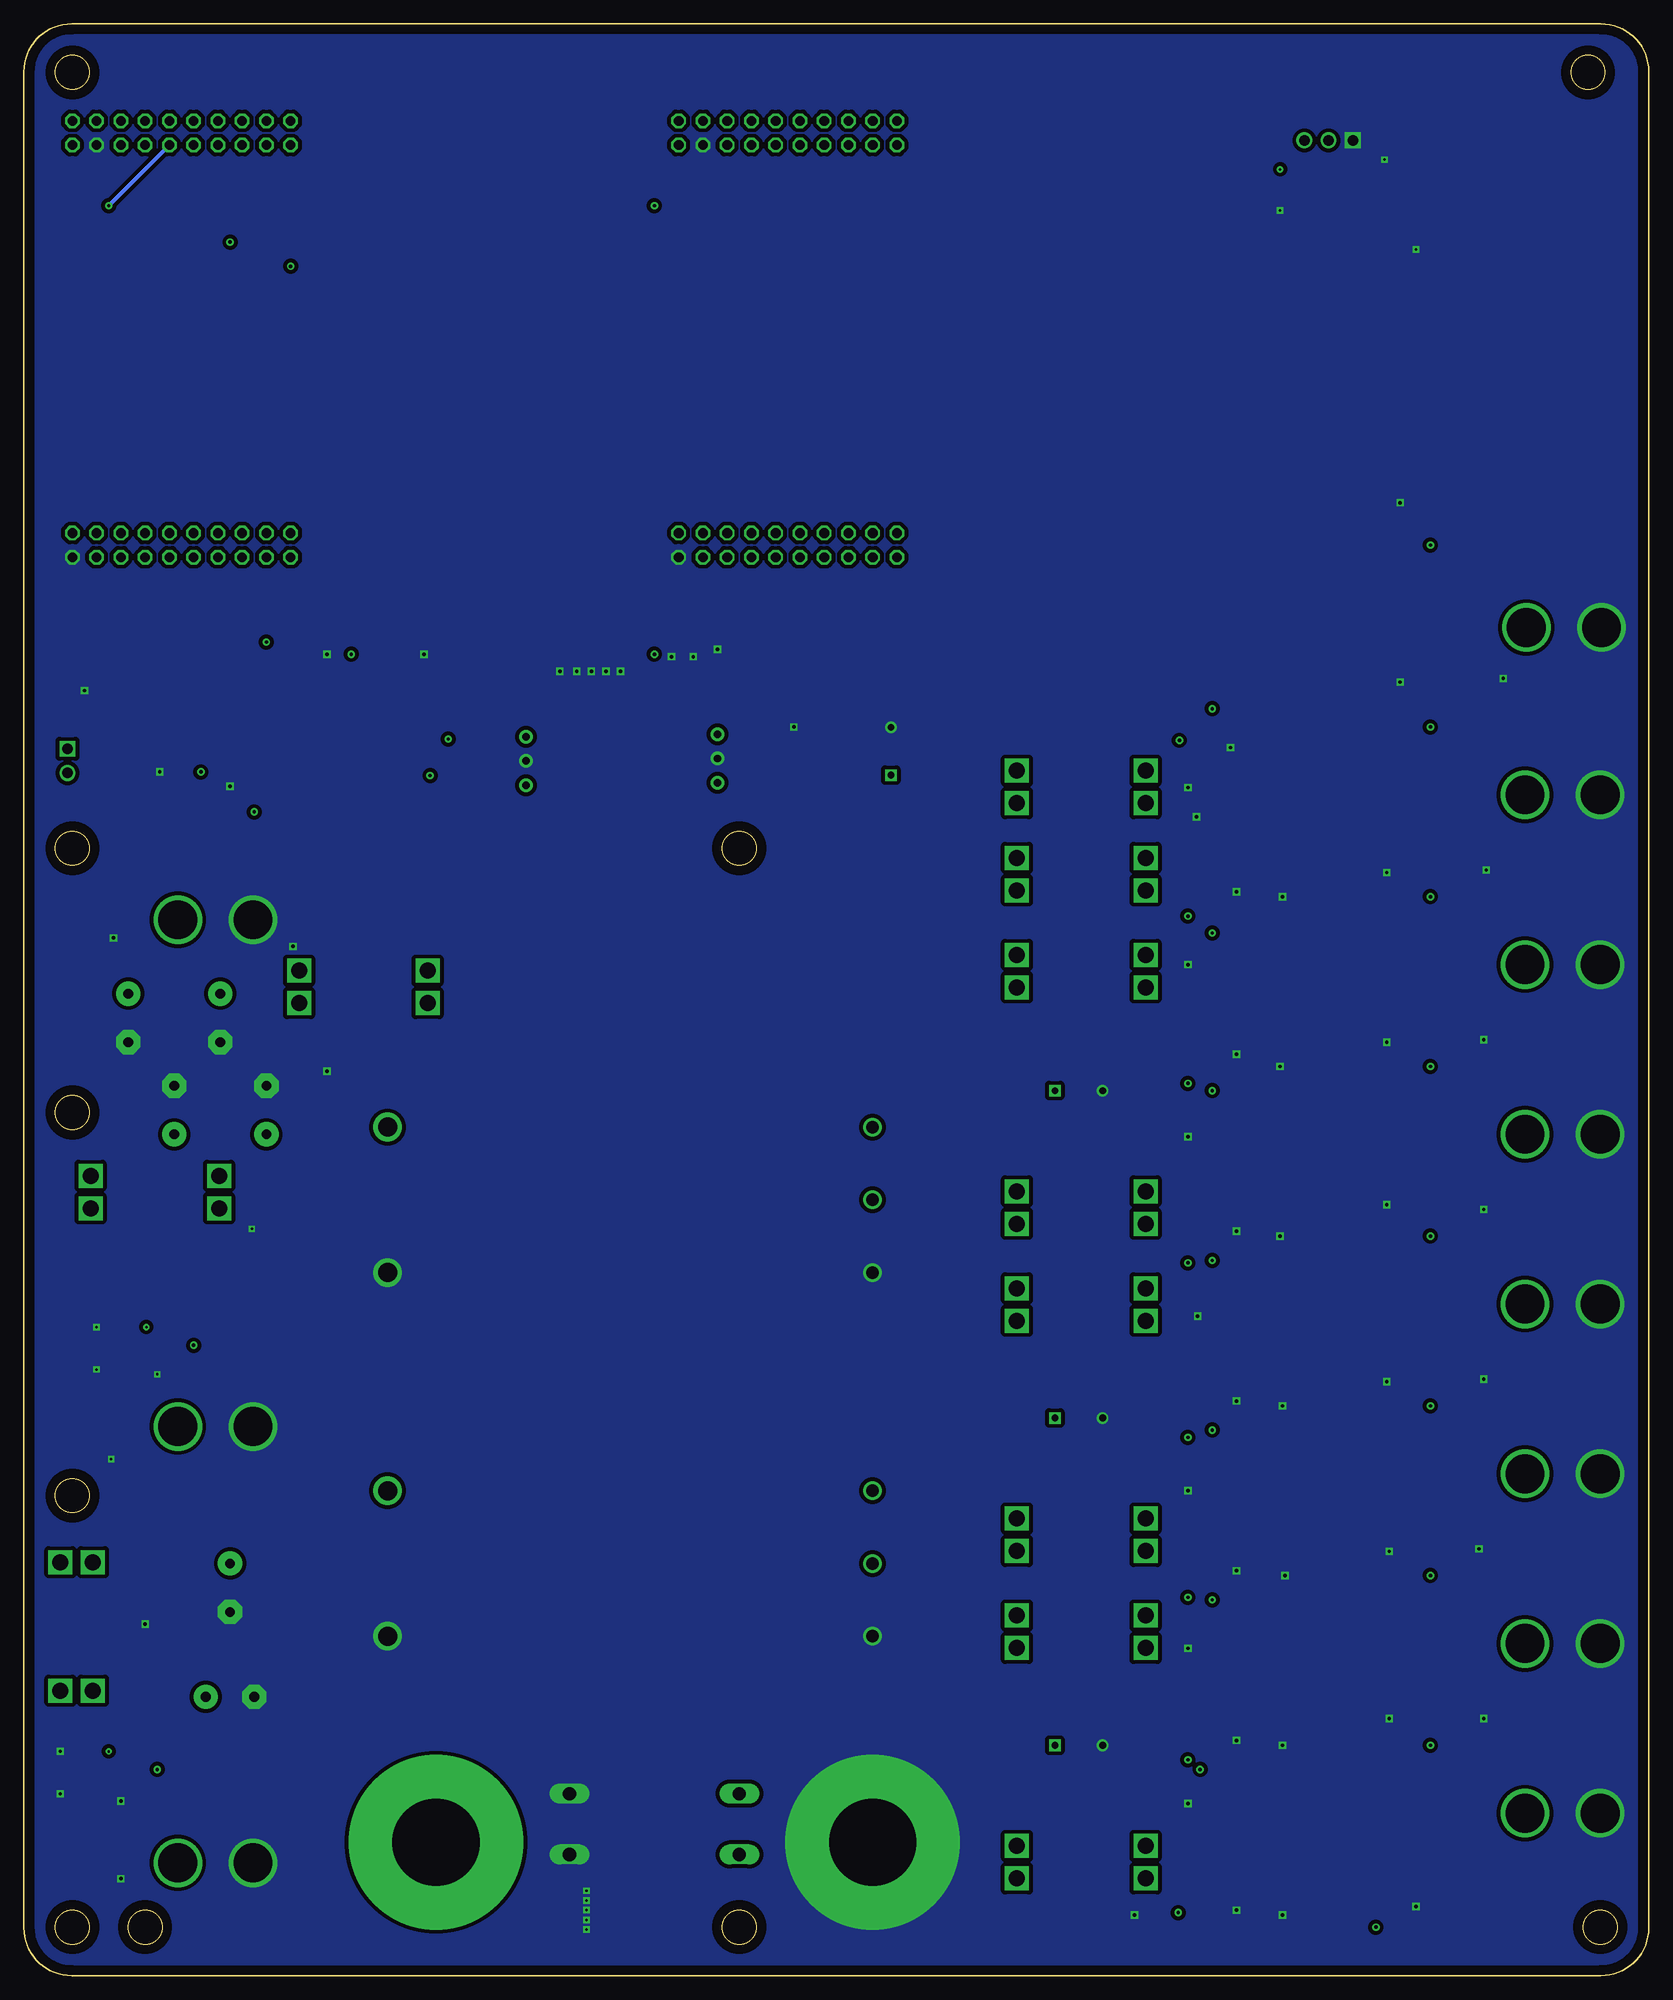
[diagram p8: board, bottom side, seen from below]

Size 170.18 x 204.47 mm. Coordinates in mm from the lower left corner, seen from the top.
Outline: 0,5 0,199.47 arc-90 5,204.47 165.18,204.47 arc-90 170.18,199.47 170.18,5 arc-90 165.18,0 5,0 arc-90 0,5
Copper layers (1*2*15*16): Top 0.035mm / dielectric 1.5mm / Top-Mid(3v3) 0.035mm / dielectric 0.15mm / Bot-Mid(signal) 0.035mm / dielectric 0.2mm / Bottom 0.035mm
Design rules "advanced_circuits_standard *": minimum track width 5mil, minimum drill 10mil, track to track 5mil, track to pad 5mil, pad to pad 5mil, via to via 5mil, smd to smd 5mil, copper to edge 40mil, drill to drill 5mil, minimum pad ring 10mil, minimum via ring 8mil, stop-mask expansion 4mil, vias tented up to drill 0mil, thermal gap 10mil

### Footprints (pad centres in the part's own frame; a part is rotated, then mirrored left to right if it is on the bottom)
OKI-78SR_HORIZ = drill 0.762 pad 1.422: 1 0,0; 2 -2.54,0; 3 -5.08,0
MOLEX-70543-0001 = drill 1.1 square: 1 1.27,0 | drill 1.1: 2 -1.27,0
LARGE_TERMINAL_HOLE = drill 9.144 pad 18.288: P$1 0,0
MOLEX-70543-0002 = drill 1.1 square: 1 2.54,0 | drill 1.1: 2 0,0; 3 -2.54,0
0805 = smd 0.8 x 1.2: 1 -0.9,0; 2 0.9,0
1206 = smd 1.6 x 1.8: 1 -1.4,0; 2 1.4,0
C_12.5MM = drill 0.7 square: + -2.5,0 | drill 0.7: - 2.5,0
E5-8,5 = drill 1.016 pad 2.54: + -2.54,0 | drill 1.016 pad 2.54 octagon: - 2.54,0
CB429-17 = drill 1.397 long: A 8.89,0; C -8.89,0
APP45_12V_VERT_CONFIG = drill 4.064: GND 4.699,3.937; VCC 4.699,11.811
LED-1206 = smd 1.2 x 1.4: A -1.5,0; C 1.5,0
U-T48-QB-NO_TRIM = drill 1.3: 1 -25.4,7.62; 2 -25.4,0; 3 -25.4,-7.62 | drill 2: 4 25.4,-7.62; 8 25.4,7.62
D2PACK = smd 2.083 x 3.81: 1 2.54,-4.191; 2 7.62,-4.191 | smd 10.16 x 7.62: TAB 5.08,6.604
DPAK = smd 1.6 x 3: 1 -2.28,-5.31; 3 2.28,-5.31 | smd 4.826 x 5.715: 4 0,1.588
SOT323 = smd 0.7 x 0.7: 1 -0.65,-0.925; 2 0.65,-0.925; 3 0,0.925
R1206 = smd 1.6 x 1.803: 1 -1.422,0; 2 1.422,0
SOIC8_ACS711 = smd 1.92 x 2.2: 1 -1.27,-2.6; 4 1.27,-2.6 | smd 0.6 x 2.2: 5 1.905,2.6; 6 0.635,2.6; 7 -0.635,2.6; 8 -1.905,2.6
SO8 = smd 0.6 x 2.2: 1 -1.905,-2.6; 2 -0.635,-2.6; 3 0.635,-2.6; 4 1.905,-2.6; 5 1.905,2.6; 6 0.635,2.6; 7 -0.635,2.6; 8 -1.905,2.6
TIVA-C-CONNECTED = drill 1.016 octagon: +3V3_1 59.69,54.61; +3V3_2 123.19,54.61; +5V_1 59.69,52.07; +5V_2 123.19,52.07; GND_1 57.15,52.07; GND_2 59.69,8.89; GND_3 120.65,52.07; GND_4 123.19,8.89; PA4 39.37,52.07; PA5 36.83,52.07; PA6 105.41,52.07; PA7 52.07,8.89; PB2 102.87,54.61; PB3 100.33,54.61; PB4 54.61,52.07; PB5 52.07,52.07; PC4 118.11,54.61; PC5 115.57,54.61; PC6 113.03,54.61; PC7 105.41,54.61; PD0 107.95,8.89; PD1 110.49,8.89; PD2 57.15,54.61; PD3 107.95,54.61; PD4 49.53,54.61; PD5 46.99,54.61; PD7 107.95,52.07; PE0 118.11,52.07; PE1 115.57,52.07; PE2 113.03,52.07; PE3 110.49,52.07; PE4 120.65,54.61; PE5 110.49,54.61; PF1 123.19,11.43; PF2 120.65,11.43; PF3 118.11,11.43; PG0 115.57,11.43; PG1 59.69,11.43; PH0 44.45,11.43; PH1 41.91,11.43; PH2 118.11,8.89; PH3 115.57,8.89; PK0 49.53,52.07; PK1 46.99,52.07; PK2 44.45,52.07; PK3 41.91,52.07; PK4 57.15,11.43; PK5 54.61,11.43; PK6 39.37,11.43; PK7 36.83,11.43; PL0 107.95,11.43; PL1 105.41,11.43; PL2 102.87,11.43; PL3 100.33,11.43; PL4 113.03,11.43; PL5 110.49,11.43; PM0 52.07,11.43; PM1 49.53,11.43; PM2 46.99,11.43; PM3 120.65,8.89; PM4 102.87,52.07; PM5 100.33,52.07; PM6 36.83,8.89; PM7 57.15,8.89; PN2 105.41,8.89; PN3 102.87,8.89; PN4 36.83,54.61; PN5 39.37,54.61; PP0 54.61,54.61; PP1 52.07,54.61; PP2 100.33,8.89; PP3 41.91,8.89; PP4 41.91,54.61; PP5 54.61,8.89; PQ0 44.45,54.61; PQ1 39.37,8.89; PQ2/PA3 46.99,8.89; PQ3/PA2 44.45,8.89; RST1 49.53,8.89; RST_2 113.03,8.89
SOIC16 = smd 0.6 x 1.55: 1 -4.445,-2.7; 2 -3.175,-2.7; 3 -1.905,-2.7; 4 -0.635,-2.7; 5 0.635,-2.7; 6 1.905,-2.7; 7 3.175,-2.7; 8 4.445,-2.7; 9 4.445,2.7; 10 3.175,2.7; 11 1.905,2.7; 12 0.635,2.7; 13 -0.635,2.7; 14 -1.905,2.7; 15 -3.175,2.7; 16 -4.445,2.7
BLOCK_3557-2 = drill 1.676 square: IN_1 16.637,-1.651; IN_2 16.637,-5.055; OUT_1 3.175,-1.651; OUT_2 3.175,-5.055
APP45_MOCO_VERT_CONFIG = drill 4.064: GND 3.937,3.175; VCC 3.937,11.049

### Placement (x,y rotation side)
3.3V-OKI  117.6,124.71 270 top
5V-OKI  97.54,124.97 270 top
5VFAN1  165.61,127.25 90 top
BATT-NEG  81.28,13.97 0 top
BATT-POS  127,13.97 0 top
BMS_SERIAL  33.53,192.28 180 top
C.1  106.93,4.57 0 top
C.2  40.64,6.35 180 top
C.3  51.44,6.35 180 top
C.4  106.93,6.35 0 top
C.5  106.93,8.38 0 top
C.6  163.83,19.05 0 top
C.7  48.26,20.32 90 top
C.8  40.64,21.84 0 top
C.9  163.83,23.5 180 top
C.10  40.64,24.13 180 top
C.11  59.69,24.13 180 top
C.12  148.59,29.21 180 top
C.13  157.48,33.02 90 top
C.14  48.26,36.83 90 top
C.15  40.64,40.13 0 top
C.16  148.59,40.64 270 top
C.17  40.64,41.91 180 top
C.18  48.26,53.34 90 top
C.19  40.64,57.91 0 top
C.20  59.69,58.42 180 top
C.21  40.64,59.69 180 top
C.22  160.02,63.5 0 top
C.23  160.02,67.94 180 top
C.24  48.26,71.12 90 top
C.25  40.64,75.69 0 top
C.26  40.64,77.47 180 top
C.27  144.78,81.28 270 top
C.28  48.26,90.17 90 top
C.29  144.78,90.68 90 top
C.30  154.43,90.68 90 top
C.31  59.69,92.71 180 top
C.32  40.64,93.47 0 top
C.33  40.64,95.25 180 top
C.34  138.43,90.93 90 top
C.35  149.61,100.33 270 top
C.36  159.26,100.33 270 top
C.37  48.26,107.95 90 top
C.38  40.64,111 0 top
C.39  40.64,113.03 180 top
C.40  46.48,122.81 180 top
C.41  149.61,126.11 0 top
C.42  153.92,126.11 0 top
C.43  79.38,128.27 90 top
C.44  40.64,128.91 180 top
C.45  48.26,127 90 top
C.46  45.72,127 270 top
C.51  117.35,135.38 90 top
C.52  119.63,135.38 90 top
C.53  121.92,135.38 90 top
C.54  97.54,135.89 90 top
C.55  100.08,135.89 90 top
C.56  102.36,135.89 90 top
C.83  27.69,187.96 90 top
C.84  38.61,187.2 270 top
C.85  24.38,186.94 270 top
C.86  27.69,183.39 270 top
C.92  26.92,180.85 180 top
D1  104.14,12.7 0 top
D2  104.14,19.05 0 top
J1  142.24,16.51 270 top
J2  142.24,62.23 270 top
J3  142.24,115.32 270 top
LED-1  22.23,5.71 90 top
LED-2  163.83,10.16 180 top
LED-3  15.24,25.4 90 top
LED-4  15.24,43.18 90 top
LED-5  162.56,55.88 180 top
LED-6  15.24,60.96 90 top
LED-7  15.24,78.74 90 top
LED-8  15.24,96.52 90 top
LED-9  162.31,110.49 180 top
LED-10  15.24,114.3 90 top
LED-11  15.24,132.08 90 top
MORTY-12V  106.68,43.18 0 top
Q1  29.84,19.68 270 top
Q2  29.84,38.1 270 top
Q3  29.84,55.88 270 top
Q4  29.84,73.66 270 top
Q5  158.75,73.66 270 top
Q6  29.84,91.44 270 top
Q7  29.84,109.22 270 top
Q8  129.03,115.82 90 top
Q9  29.84,127 270 top
Q10  29.21,146.05 270 top
Q11  138.94,136.14 90 top
Q12  128.78,136.14 90 top
Q13  165.61,133.1 180 top
R.1  18.41,5.71 270 top
R.2  163.83,13.97 0 top
R.3  11.43,25.4 270 top
R.4  11.43,43.18 270 top
R.5  162.56,59.69 0 top
R.6  11.43,60.96 270 top
R.7  11.43,78.74 270 top
R.8  11.43,96.52 270 top
R.9  162.31,113.28 0 top
R.10  11.43,114.3 270 top
R.11  19.05,132.08 270 top
R.13  89.53,134.37 90 top
R.14  92.08,134.37 270 top
R.20  145.29,136.14 90 top
R.21  142.24,136.14 90 top
R.22  134.11,136.14 90 top
R.23  131.57,136.14 90 top
RICK-12V  106.68,81.28 0 top
U1  46.35,9.53 180 top
U2  156.21,21.59 270 top
U3  24.13,24.13 180 top
U4  46.35,27.3 180 top
U5  24.13,41.91 180 top
U6  46.35,45.09 180 top
U7  24.13,59.69 180 top
U8  46.35,62.87 180 top
U9  152.4,66.04 270 top
U10  144.78,73.66 180 top
U11  24.13,77.47 180 top
U12  46.35,80.64 180 top
U13  24.13,95.25 180 top
U14  46.35,99.06 180 top
U15  137.41,109.73 90 top
U16  24.13,113.03 180 top
U17  46.35,116.2 180 top
U18  152.4,121.28 0 top
U19  24.13,130.81 180 top
U20  41.91,139.7 0 top
U21  24.13,149.86 180 top
U22  45.72,133.35 180 top
U23  33.53,183.39 270 top
U$1  5.08,5.08 0 top
U$2  95.25,5.08 0 top
U$3  157.48,5.08 0 top
U$4  165.1,5.08 0 top
U$5  49.53,15.24 0 top
U$6  1.91,20.95 270 top
U$7  161.29,26.67 90 top
U$8  103.63,38.86 0 top
U$9  1.91,38.73 270 top
U$10  49.53,39.37 0 top
U$11  49.53,49.53 0 top
U$12  165.1,50.29 0 top
U$13  1.91,56.52 270 top
U$14  49.53,73.66 0 top
U$15  1.91,74.3 270 top
U$16  166.37,78.74 180 top
U$17  49.53,83.82 0 top
U$18  165.1,90.42 0 top
U$19  1.91,92.08 270 top
U$20  124.71,106.93 0 top
U$21  49.53,108.58 0 top
U$22  1.91,109.86 270 top
U$23  1.78,145.16 270 top
U$24  165.1,118.11 0 top
U$25  49.53,118.75 0 top
U$26  1.91,127.64 270 top
U$27  2.03,180.59 270 top
U$28  95.25,118.11 0 top
U$29  49.53,127.89 0 top
U$30  6.35,199.39 0 top
U$31  165.1,199.39 0 top

### Tracks (layer width: path | path; a pad name or v marks a point on that pad's centre or on a via)
3.3V  (via drill 0.25, 0.35)
  Top 0.406: U1.8 48.95,6.92 v49.28,6.6 49.53,6.35 C.3.2 | C.28.2 v48.26,93.47 U14.8 | C.37.2 v48.26,111 U17.8 | C.24.2 v48.26,74.68 U12.8 | C.18.2 v48.26,56.39 U8.8 | C.14.2 v48.26,39.62 U6.8 | C.7.2 v48.26,22.61 U4.8 | C.23.2 v157.35,67.94 U9.8 | U2.8 v161.29,23.5 C.9.2 | U23.16 36.49,188.1 C.84.1 v38.61,189.23 | U18.8 150.5,126.1 C.41.2 v151.64,126.11 | C.45.2 47.62,128.53 U22.8 47.81,130.75 v49.15,129.41
  pour Top (rank 2, no thermals): 116.59,128.78 118.11,128.78 118.87,129.54 118.87,132.08 119.89,133.1 122.17,133.1 123.19,134.11 123.19,134.62 122.68,135.13 116.59,135.13 116.08,134.62 116.08,129.29
  pour Top-Mid(3v3) (rank 6, no thermals): -3.05,-3.81 -3.05,134.87 -2.29,152.65 -1.78,163.32 -0.76,164.85 -0.76,207.01 173.23,207.01 173.23,-3.81
5V  (via drill 0.35)
  Top 0.61: U20.+5V_1 101.6,187.96 v104.14,185.42 | 102.87,134.62 104.14,135.89 v104.14,138.43 105.41,138.43 107.95,140.97 150.62,140.97 5VFAN1.2
  Bot-Mid(signal) 0.61: v104.14,185.42 v104.14,138.43
  pour Top (no thermals): 98.04,129.03 99.06,130.05 99.06,132.59 100.58,134.11 103.12,134.11 103.38,134.37 103.38,135.38 103.12,135.64 96.77,135.64 96.27,135.13 96.27,129.79 97.03,129.03
12V-AUX-ACT
  Top 1.016: R.2.1 156.46,13.97
  pour Top (no thermals): 155.19,21.21 148.59,21.21 148.59,15.24 149.86,13.97 149.86,8.89 151.13,7.62 157.35,7.62 158.62,8.89 158.62,17.78
12V-AUX-COM
  Top 0.406: R.9.1 156.72,113.28 156.59,113.16
  pour Top (no thermals): 152.4,115.32 152.4,118.87 152.91,119.38 157.23,119.38 158.24,118.36 158.24,109.47 156.46,107.7 151.89,107.7 150.11,109.47 150.11,113.03
12V-AUX-LOGIC
  Top 1.016: R.5.1 156.21,59.69
  pour Top (no thermals): 148.34,65.66 151.13,65.66 156.84,59.94 156.84,55.37 155.96,54.48 152.15,54.48 151.26,55.37 151.26,57.91 148.34,60.83
232_RX
  Top 0.406: U23.13 34.67,184.02 33.53,185.17 BMS_SERIAL.2
232_TX
  Top 0.406: U23.14 34.92,185.29 34.54,185.67 34.54,190.75 BMS_SERIAL.3
ACT-CTL  (via drill 0.35)
  Top 0.406: R.20.2 145.29,139.19 v144.78,139.7
  Bot-Mid(signal) 0.406: v144.78,139.7 U20.PN3
DRAIN-ARM
  Top 0.406: C.44.2 39.37,129.28 39.37,133.35 | 30.48,144.78 28,147.26 U21.8 26.04,148.59 25.78,148.84 23.75,148.84 23.5,148.59 U21.6
  pour Top (isolate 0.254, rank 3, no thermals): 45.47,137.16 41.91,140.97 41.91,146.05 40.64,147.32 29.21,147.32 29.21,134.62 30.48,133.35 44.45,133.35 45.47,134.62
DRAIN-M1
  Top 0.406: U3.6 23.5,22.99 23.88,23.37 25.65,23.37 25.91,23.11 25.91,21.66 U3.8 28.52,19.05 31.24,19.05 | C.8.2 41.54,18.91 41.66,18.8
  pour Top (no thermals): 30.48,20.32 43.18,20.32 46.23,17.27 46.23,10.92 44.2,8.89 30.48,8.89
DRAIN-M2
  Top 0.406: U5.6 23.5,40.51 23.88,40.89 25.65,40.89 26.04,40.51 U5.8 28.52,36.83 31.24,36.83 | C.15.2 41.54,37.45 41.66,37.34
  pour Top (no thermals): 30.48,38.48 43.18,38.48 46.23,35.43 46.23,29.08 44.2,27.05 30.48,27.05
DRAIN-M3
  Top 0.406: U7.6 23.5,58.55 23.88,58.93 25.78,58.93 26.04,58.67 U7.8 28.26,54.86 31.24,54.86 | C.19.2 41.54,55.23 41.66,55.12
  pour Top (no thermals): 30.48,56.26 43.18,56.26 46.23,53.21 46.23,46.86 44.2,44.83 30.48,44.83
DRAIN-M4
  Top 0.406: C.25.2 41.54,73.29 41.4,73.15 | 31.5,72.14 28.77,72.14 U11.8 26.04,76.33 25.65,76.71 23.88,76.71 23.5,76.33 U11.6
  pour Top (no thermals): 30.48,74.04 43.18,74.04 46.23,70.99 46.23,64.64 44.2,62.61 30.48,62.61
DRAIN-M5
  Top 0.406: U13.6 23.5,93.85 23.88,94.23 25.78,94.23 26.04,93.98 U13.8 28.26,90.42 31.24,90.42 | C.32.2 41.54,90.82 41.4,90.68
  pour Top (no thermals): 30.48,91.82 43.18,91.82 46.23,88.77 46.23,82.42 44.2,80.39 30.48,80.39
DRAIN-M6
  Top 0.406: U16.6 23.5,111.63 23.88,112.01 25.65,112.01 26.04,111.63 U16.8 28.01,108.46 31.5,108.46 | C.38.2 41.54,108.6 41.4,108.46
  pour Top (no thermals): 30.48,109.6 43.18,109.6 46.23,106.55 46.23,100.2 44.2,98.17 30.48,98.17
DRAIN-M7
  Top 0.406: U19.6 23.5,129.41 23.88,129.79 25.78,129.79 26.04,129.54 U19.8 28.26,125.98 31.24,125.98
  pour Top (no thermals): 30.48,127.38 43.18,127.38 46.23,124.33 46.23,117.98 44.2,115.95 30.48,115.95
FAN-CTL
  Top 0.406: U20.PM3 162.56,137.72 Q13.1
FILTER-ARM
  Top 0.406: U22.6 45.09,129.03 45.72,128.4 C.46.1
FILTER-M1
  Top 0.406: U1.6 45.72,5.08 45.21,4.57 43.32,4.57 C.2.1
FILTER-M2
  Top 0.406: U4.6 45.72,23.11 45.21,22.61 42.67,22.61 41.54,23.74 C.10.1
FILTER-M3
  Top 0.406: U6.6 45.72,40.89 45.21,40.39 43.06,40.39 C.17.1
FILTER-M4
  Top 0.406: U8.6 45.72,58.67 45.21,58.17 43.06,58.17 C.21.1
FILTER-M5
  Top 0.406: U12.6 45.72,76.45 45.21,75.95 43.06,75.95 C.26.1
FILTER-M6
  Top 0.406: U14.6 45.72,94.74 44.7,93.73 43.06,93.73 C.33.1
FILTER-M7
  Top 0.406: U17.6 45.72,112.01 44.96,111.25 43.32,111.25 C.39.1
GATE-ARM
  Top 0.406: U21.5 22.23,144.15 22.86,143.51 Q10.1
GATE-M1
  Top 0.406: U3.5 22.23,18.67 23.75,17.14 Q1.1
GATE-M2
  Top 0.406: U5.5 22.23,36.7 23.37,35.56 Q2.1
GATE-M3
  Top 0.406: U7.5 22.23,54.48 23.37,53.34 Q3.1
GATE-M4
  Top 0.406: U11.5 22.23,72.14 23.24,71.12 Q4.1
GATE-M5
  Top 0.406: U13.5 22.23,89.92 23.24,88.9 Q6.1
GATE-M6
  Top 0.406: U16.5 22.23,107.57 23.11,106.68 Q7.1
GATE-M7
  Top 0.406: U19.5 22.23,125.22 22.99,124.46 Q9.1
GND  (via drill 0.25, 0.35)
  Top 0.406: C.13.2 v157.48,36.83 | LED-2.C v160.02,10.16 | C.9.1 v166.37,23.5 | C.6.2 v166.37,19.05 | C.18.1 v48.26,50.8 | C.17.2 v38.1,41.91 38.1,40.89 38.86,40.13 C.15.1 | LED-4.C 17.76,44.68 v17.78,44.7 | C.2.2 v38.35,6.35 | LED-1.C 24.36,7.21 v24.38,7.24 | LED-3.C 17.25,26.9 v17.27,26.92 | U3.1 26.23,26.92 v27.18,26.92 | U1.5 43.25,6.92 v43.18,6.86 | C.3.1 v53.85,6.35 | C.7.1 v48.26,18.03 | U4.5 44.38,24.64 v43.18,24.64 | C.10.2 v38.35,24.13 38.35,22.61 39.12,21.84 C.8.1 | U6.5 43.25,42.48 v43.18,42.42 | U8.5 43.25,60.27 v43.18,60.2 | U7.1 27.37,62.29 v27.43,62.23 | LED-6.C 17.25,62.46 v17.27,62.48 | U12.5 43.25,78.05 v43.18,77.98 | C.24.1 47.24,69.2 v47.24,69.09 | C.26.2 v38.61,77.47 38.61,76.2 39.12,75.69 C.25.1 | U11.1 26.74,80.77 v27.43,80.77 | LED-7.C 17.25,80.24 v17.27,80.26 | LED-8.C 15.26,98.04 v17.27,98.04 | U13.1 27.37,97.85 v27.43,97.79 | C.33.2 v38.61,95.25 38.61,94.23 39.37,93.47 C.32.1 | U14.5 43.24,96.46 v43.18,96.52 | C.28.1 v48.26,87.88 | LED-10.C 16.99,115.8 v17.02,115.82 | U16.1 27.37,115.63 v27.43,115.57 | C.39.2 v38.35,113.03 38.35,111.76 39.12,111 C.38.1 | U17.5 43.25,113.61 v43.18,113.54 | C.37.1 v48.26,105.92 | C.14.1 v48.26,34.29 | U2.5 160.02,18.48 v160.02,18.29 | U5.1 27.12,44.51 v27.18,44.45 | C.21.2 v38.35,59.69 38.35,58.67 39.12,57.91 C.19.1 | C.23.1 v162.56,67.94 | C.22.2 v162.56,63.5 | U9.5 156.14,62.99 v156.21,62.99 | U10.1 146.69,77.85 v146.3,78.23 146.3,78.36 C.27.2 | R.23.2 130.8,136.79 Q12.2 128.27,138.23 v128.27,138.43 | R.21.2 141.47,136.79 Q11.2 138.43,138.23 v138.43,138.43 | R.13.1 v89.53,130.81 | U23.15 38.34,186.56 C.84.2 v38.61,184.91 | C.92.2 v24.38,180.85 | C.83.2 v27.69,190.25 | LED-5.C 161.06,54.13 v161.04,54.1
  Top 0.406: U15.1 v141.99,107.82 | C.41.1 148.59,126 v148.59,124.59 | U18.5 154.31,125.59 C.42.2 v155.96,126.11 | LED-9.C 160.81,108.74 v160.78,108.71 | C.34.2 v138.43,94.74 | C.40.1 47.38,121.42 v47.37,121.41 | LED-11.C v15.24,135.89 | U22.5 v43.81,128.65 41.79,128.65 C.44.1 | C.46.2 C.45.1 v48.26,124.46 | U21.1 v26.04,154.31 | U19.1 v26.04,135.51 | Q13.2 164.43,134.02 v163.83,134.62
  Top 0.508: C.54.2 v97.54,138.94 | C.55.2 v100.08,138.18 | C.56.2 v102.36,138.18
  other vias: 111.25,8.89 111.25,7.87 111.25,6.86 111.25,5.84 111.25,4.83 107.7,136.65 109.22,136.65 110.74,136.65 112.27,136.65 114.05,136.65
  pour Top (no thermals): 107.44,9.65 111.51,9.65 111.76,9.4 111.76,3.81 111.51,3.56 107.44,3.56 107.19,3.81 107.19,9.4
  pour Top (no thermals): 106.68,135.64 122.68,135.64 122.94,135.89 122.94,136.65 121.92,137.67 106.68,137.67 105.92,136.91 105.92,136.4
  pour Bottom (isolate 0.406, rank 6, no thermals): 204.22,124.46 174.75,146.3 170.43,146.81 170.43,205.49 -1.27,205.49 -1.27,161.54 -18.8,153.92 -18.8,135.13 0.51,129.79 0.51,0.25 169.67,0.25 169.67,124.97
IMEAS-ACT  (via drill 0.35)
  Top 0.406: U2.7 158.18,21.59 v156.21,21.59
  Bot-Mid(signal) 0.406: v156.21,21.59 156.21,46.99 158.75,49.53 158.75,91.44 162.56,95.25 162.56,116.39 162.09,116.86 162.09,145.25 161.29,146.05 v161.29,185.42
  Bottom 0.406: v161.29,185.42 U20.PE2
IMEAS-ARM  (via drill 0.35)
  Top 0.406: U22.7 46.35,132.08 v45.72,132.72
  Top-Mid(3v3) 0.406: v45.72,132.72 38.73,132.72 37.47,133.99 37.47,157.48 110.49,157.48 123.19,144.78 146.05,144.78 U20.PD0
IMEAS-COM  (via drill 0.35)
  Top 0.406: U18.7 151.76,122.56 151.13,121.92 v146.05,121.92
  Top-Mid(3v3) 0.406: v146.05,121.92 146.05,132.08 151.13,137.16 151.13,181.61 157.48,187.96 U20.PE1
IMEAS-LOGIC  (via drill 0.35)
  Top 0.406: U9.7 154.37,66.04 v152.4,66.04
  Bot-Mid(signal) 0.406: v152.4,66.04 148.59,66.04 147.32,67.31 147.32,105.41 149.86,107.95 149.86,133.35 156.21,139.7 156.21,173.99 160.02,177.8 U20.PE0
IMEAS-M1  (via drill 0.35)
  Top 0.406: U1.7 46.99,3.81 45.72,2.54 29.84,2.54 28.57,3.81 v28.57,5.08
  Top-Mid(3v3) 0.406: v28.57,5.08 28.57,157.48 60.33,189.23 81.28,189.23 U20.PK3
IMEAS-M2  (via drill 0.35)
  Top 0.406: U4.7 v46.99,21.59
  Top-Mid(3v3) 0.406: v46.99,21.59 31.75,21.59 29.84,23.5 29.84,157.48 60.33,187.96 82.55,187.96 U20.PK2
IMEAS-M3  (via drill 0.35)
  Top 0.406: U6.7 46.99,40.64 v45.72,39.37
  Top-Mid(3v3) 0.406: v45.72,39.37 31.75,39.37 31.11,40.01 31.11,157.48 60.33,186.69 83.82,186.69 U20.PK1
IMEAS-M4  (via drill 0.35)
  Top 0.406: U8.7 46.99,58.42 v45.72,57.15
  Top-Mid(3v3) 0.406: v45.72,57.15 33.66,57.15 32.38,58.42 32.38,157.48 60.33,185.42 85.09,185.42 U20.PK0
IMEAS-M5  (via drill 0.35)
  Top 0.406: U12.7 46.99,76.2 v45.72,74.93
  Top-Mid(3v3) 0.406: v45.72,74.93 34.92,74.93 33.66,76.2 33.66,157.48 60.33,184.15 86.36,184.15 U20.PB5
IMEAS-M6  (via drill 0.35)
  Top 0.406: U14.7 46.99,93.98 v45.72,92.71
  Top-Mid(3v3) 0.406: v45.72,92.71 36.2,92.71 34.92,93.98 34.92,157.48 60.33,182.88 87.63,182.88 U20.PB4
IMEAS-M7  (via drill 0.35)
  Top 0.406: U17.7 46.99,110.49 v45.72,109.22
  Top-Mid(3v3) 0.406: v45.72,109.22 37.47,109.22 36.2,110.49 36.2,157.48 60.33,181.61 142.24,181.61 U20.PE3
LEDLINE-ARM
  Top 0.406: 15.14,130.68 LED-11.A 15.34,130.68 R.11.2
LEDLINE-M1
  Top 0.406: R.1.2 22.12,4.32 LED-1.A
LEDLINE-M2
  Top 0.406: R.3.2 15.14,24 LED-3.A
LEDLINE-M3
  Top 0.406: R.4.2 15.14,41.78 LED-4.A
LEDLINE-M4
  Top 0.406: R.6.2 15.14,59.56 LED-6.A
LEDLINE-M5
  Top 0.406: R.7.2 15.14,77.34 LED-7.A
LEDLINE-M6
  Top 0.406: R.8.2 15.14,95.12 LED-8.A
LEDLINE-M7
  Top 0.406: R.10.2 15.14,112.9 LED-10.A
LOGIC/COM-CTL  (via drill 0.35)
  Top 0.406: R.22.2 135.03,137.57 v135.89,138.43
  Bot-Mid(signal) 0.406: v135.89,138.43 142.24,144.78 U20.PP2
N$1
  pour Top (no thermals): 134.62,53.34 142.24,45.72 167.64,45.72 168.91,44.45 168.91,41.91 167.64,40.64 138.43,40.64 129.54,49.53 129.54,52.07 130.81,53.34
N$3  (via drill 0.35)
  Top 0.406: Q12.3 125.73,134.02 v125.73,129.54
  Bot-Mid(signal) 0.406: v125.73,129.54 81.28,85.09 RICK-12V.2
N$4
  Top 0.406: U9.6 157.23,65.41 159.12,63.51 C.22.1
N$5
  Top 0.406: Q13.3 5VFAN1.1
N$6
  Top 0.406: R.2.2 165.33,13.87 LED-2.A
N$7
  Top 0.406: LED-9.A 163.71,110.59 R.9.2
N$8  (via drill 0.35)
  Top 0.406: Q11.3 127.64,125.77 v127.64,125.73
  Bot-Mid(signal) 0.406: v127.64,125.73 85.09,83.19 85.09,46.99 MORTY-12V.2
N$9
  pour Top (isolate 0.305, no thermals): 129.79,87.38 135.13,82.04 145.29,82.04 149.1,78.23 154.94,78.23 159,82.3 159,87.12 169.16,97.28 169.16,104.65 167.13,106.68 139.19,106.68 138.43,105.92 138.43,101.09 139.19,100.33 155.45,100.33 156.46,99.31 156.46,97.03 150.37,90.93 130.81,90.93 129.79,89.92
N$11
  Top 0.406: U23.2 29.08,186.56 28.7,186.94 27.8,186.94 C.83.1
N$12
  Top 0.406: U2.6 161.04,20.95 161.04,20.94 C.6.1
N$15
  Top 0.406: U18.6 153.03,126.1 C.42.1
N$16
  Top 0.406: R.5.2 164.06,59.59 LED-5.A
N$17
  Top 0.406: U15.5 134.34,112.11 Q8.1
N$18
  pour Top (no thermals): 152.4,33.02 167.64,33.02 168.91,31.75 168.91,27.94 167.64,26.67 159.89,26.67 155.19,21.97 148.59,21.97 148.59,29.21
N$19
  pour Top (no thermals): 132.84,119.38 151.38,119.38 151.89,118.87 151.89,115.82 151.38,115.32 133.1,115.32 132.59,115.82 132.59,119.13
N$20
  Top 0.406: U15.6 136.27,110.36 136.65,109.98 136.65,108.2 136.27,107.82 U15.8 | U15.8 135.25,107.82 135.13,107.7 | U15.8 129.67,107.82 129.54,107.95
  pour Top (no thermals): 130.05,118.62 130.56,118.11 130.56,101.09 129.79,100.33 124.71,100.33 124.21,100.84 124.21,118.11 124.71,118.62
N$21
  Top 0.406: U10.6 144.15,72.26 145.29,73.41 147.83,73.41 | 147.83,73.41 157.73,73.41 | U10.8 146.69,72.26 147.83,73.41
  pour Top (no thermals): 157.48,70.87 168.15,70.87 169.16,71.88 169.16,85.34 167.89,86.61 163.83,86.61 162.56,85.34 162.56,81.79 156.97,76.2 156.97,71.37
N$22
  pour Top (no thermals): 148.34,66.42 151.13,66.42 155.07,70.36 155.45,70.36 155.96,70.87 155.96,72.14 155.45,72.64 148.84,72.64 148.34,72.14
N$25
  Top 0.406: R.20.1 R.21.1 140.63,134.72 Q11.1
N$28
  Top 0.406: U10.5 142.88,73.28 143.76,74.17 151.67,74.17 Q5.1
N$40
  Top 0.406: U23.1 24.39,187.83 C.85.1
N$42
  Top 0.406: U23.3 28.57,185.29 27.69,186.18 24.52,186.18 C.85.2
N$43
  Top 0.406: U23.4 29.08,184.02 28.82,184.29 C.86.1
N$44
  Top 0.406: U23.5 29.34,182.75 29.07,182.49 C.86.2
N$45
  Top 0.406: U23.6 29.59,181.48 28.96,180.85 C.92.1
N$114
  Top 0.406: R.22.1 R.23.1 130.22,134.72 Q12.1
SER_RX
  Top 0.406: U23.12 153.54,182.75 158.75,187.96 158.75,193.04 U20.PC4
SER_TX  (via drill 0.35)
  Top 0.406: U23.11 148.46,181.48 v148.59,181.61
  Top-Mid(3v3) 0.406: v148.59,181.61 156.21,189.23 156.21,193.04 U20.PC5
SIG-ARM  (via drill 0.35)
  Top 0.406: U21.4 22.23,150.5 v22.86,149.86
  Bot-Mid(signal) 0.406: U20.PK5 87.63,160.02 38.1,160.02 27.94,149.86 v22.86,149.86
SIG-M1  (via drill 0.35)
  Top 0.406: U3.4 22.23,24.77 v22.86,24.13
  Bot-Mid(signal) 0.406: U20.PK7 38.1,151.13 35.56,148.59 35.56,25.4 34.29,24.13 v22.86,24.13
SIG-M2  (via drill 0.35)
  Top 0.406: U5.4 22.23,42.55 v22.86,41.91
  Bot-Mid(signal) 0.406: U20.PK6 80.01,152.4 38.1,152.4 34.29,148.59 34.29,43.18 33.02,41.91 v22.86,41.91
SIG-M3  (via drill 0.35)
  Top 0.406: U7.4 22.23,60.33 v22.86,59.69
  Bot-Mid(signal) 0.406: U20.PH1 81.28,153.67 38.1,153.67 33.02,148.59 33.02,60.96 31.75,59.69 v22.86,59.69
SIG-M4  (via drill 0.35)
  Top 0.406: U11.4 22.23,78.11 v22.86,77.47
  Bot-Mid(signal) 0.406: U20.PH0 82.55,154.94 38.1,154.94 31.75,148.59 31.75,78.74 30.48,77.47 v22.86,77.47
SIG-M5  (via drill 0.35)
  Top 0.406: U13.4 22.23,95.89 v22.86,95.25
  Bot-Mid(signal) 0.406: U20.PM2 83.82,156.21 38.1,156.21 30.48,148.59 30.48,96.52 29.21,95.25 v22.86,95.25
SIG-M6  (via drill 0.35)
  Top 0.406: 22.23,116.46 U16.4 22.23,113.67 v22.86,113.03
  Bot-Mid(signal) 0.406: U20.PM1 85.09,157.48 38.1,157.48 29.21,148.59 29.21,114.3 27.94,113.03 v22.86,113.03
SIG-M7  (via drill 0.35)
  Top 0.406: U19.4 22.23,131.44 v22.86,130.81
  Bot-Mid(signal) 0.406: U20.PM0 86.36,158.75 38.1,158.75 27.94,148.59 27.94,132.08 26.67,130.81 v22.86,130.81
SOURCE-ARM
  Top 0.406: R.11.1 19.05,138.43
  pour Top (no thermals): 27.43,137.16 27.43,142.11 17.78,142.11 15.24,144.78 10.16,144.78 8.89,143.51 8.89,138.43 10.16,137.16
SOURCE-M1
  Top 0.406: R.1.1 18.41,10.54 18.54,10.67
  pour Top (no thermals): 11.43,20.32 15.24,20.32 16.51,19.05 16.51,17.78 18.41,15.88 27.81,15.88 27.81,10.16 13.97,10.16 8.89,15.24 8.89,17.78
SOURCE-M2
  Top 0.406: R.3.1 11.43,28.96 12.45,29.97
  pour Top (no thermals): 11.43,38.1 15.24,38.1 16.51,36.83 16.51,35.56 17.78,34.29 27.94,34.29 27.94,29.21 12.7,29.21 8.89,33.02 8.89,35.56
SOURCE-M3
  Top 0.406: R.4.1 11.43,46.99 12.7,48.26
  pour Top (no thermals): 11.43,55.88 15.24,55.88 16.51,54.61 16.51,53.34 17.78,52.07 27.94,52.07 27.94,46.99 12.7,46.99 8.89,50.8 8.89,53.34
SOURCE-M4
  Top 0.406: R.6.1 11.43,65.02 12.45,66.04
  pour Top (no thermals): 11.43,73.66 15.24,73.66 16.51,72.39 16.51,71.12 17.78,69.85 27.94,69.85 27.94,64.77 12.7,64.77 8.89,68.58 8.89,71.12
SOURCE-M5
  Top 0.406: R.7.1 11.43,82.55 12.45,83.57
  pour Top (no thermals): 11.43,91.44 15.24,91.44 16.51,90.17 16.51,88.9 17.78,87.63 27.94,87.63 27.94,82.55 12.7,82.55 8.89,86.36 8.89,88.9
SOURCE-M6
  Top 0.406: R.8.1 11.43,100.58 12.45,101.6
  pour Top (no thermals): 11.43,109.22 15.24,109.22 16.51,107.95 16.51,106.68 17.78,105.41 27.94,105.41 27.94,100.33 12.7,100.33 8.89,104.14 8.89,106.68
SOURCE-M7
  Top 0.406: R.10.1 11.43,118.11 12.45,119.13
  pour Top (no thermals): 11.43,127 15.24,127 16.51,125.73 16.51,124.46 17.78,123.19 27.94,123.19 27.94,118.11 12.7,118.11 8.89,121.92 8.89,124.46
V_BATT
  Top 0.406: R.14.2 92.08,126.36 92.71,125.73
  pour Top (isolate 1.016, rank 2, no thermals): 60.96,128.27 120.02,128.27 121.54,126.75 122.3,125.86 122.68,125.48 122.68,27.94 126.49,24.13 138.43,24.13 139.7,22.86 139.7,3.81 138.43,2.54 60.96,2.54 59.69,3.81 59.69,127
  pour Top-Mid(3v3) (isolate 0.813, no thermals): 60.96,128.27 120.14,128.27 122.68,125.48 122.68,27.94 126.49,24.13 138.43,24.13 139.7,22.86 139.7,3.81 138.43,2.54 60.96,2.54 59.69,3.81 59.69,127
V_BATT_ARM
  pour Top (isolate 0.254, rank 2, no thermals): 49.53,121.92 50.8,120.65 53.34,120.65 54.61,121.92 54.61,135.89 52.07,138.43 46.99,138.43 45.97,137.16 45.97,134.24 46.86,133.35 48.26,133.35 49.53,132.08
V_BATT_M1
  pour Top (no thermals): 46.74,10.92 49.28,8.38 53.85,8.38 54.61,9.14 54.61,14.73 53.85,15.49 49.02,15.49 46.74,13.21
V_BATT_M2
  pour Top (no thermals): 46.74,28.7 50.29,28.7 54.36,32.77 54.36,38.86 53.85,39.37 51.56,39.37 51.05,38.86 51.05,35.31 46.74,30.99
V_BATT_M3
  pour Top (no thermals): 46.74,46.48 50.55,42.67 54.1,42.67 54.61,43.18 54.61,49.28 54.1,49.78 47.75,49.78 46.74,48.77
V_BATT_M4
  pour Top (no thermals): 46.74,66.55 50.55,70.36 50.55,72.9 51.56,73.91 54.1,73.91 54.86,73.15 54.86,67.06 52.07,64.26 46.74,64.26
V_BATT_M5
  pour Top (no thermals): 46.74,82.3 50.8,78.23 50.8,77.72 51.56,76.96 54.1,76.96 54.61,77.47 54.61,83.57 53.34,84.84 46.74,84.84
V_BATT_M6
  pour Top (no thermals): 46.74,102.87 50.8,106.93 50.8,108.2 51.56,108.97 53.85,108.97 54.61,108.2 54.61,102.36 52.58,100.33 46.74,100.33
V_BATT_M7
  pour Top (no thermals): 46.74,117.6 50.8,113.54 50.8,112.52 51.56,111.76 54.1,111.76 54.61,112.27 54.61,118.62 53.34,119.89 46.74,119.89
VMEAS-VBATT  (via drill 0.35)
  Top 0.406: R.13.2 R.14.1 92.08,138.43 97.16,143.51 100.33,143.51 135.89,179.07 v142.24,179.07
  Bot-Mid(signal) 0.406: v142.24,179.07 151.13,187.96 151.13,193.04 U20.PE5

### Text on the board
tPlace: Missouri S&T / Mars Rover Design Team / Power Board 2018 Rev2 / Lucas Bonskowski | ARM | FUSE BLOCK | 20A | FUSE BLOCK | 30A | M7 | FUSE BLOCK | 30A | 5A | FUSE BLOCK | COMM 12V | M6 | FUSE BLOCK | FUSE BLOCK | 30A | M5 | 5A | FUSE BLOCK | 30A | M4 | LOGIC 12V | FUSE BLOCK | 30A | 15A | M3 | FUSE BLOCK | 30A | FUSE BLOCK | M2 | + | - | FUSE BLOCK | 30A | M1 | ACTUATION 12V